# EasyEDA schematic SCH_Paul Board_2022-11-26.json

## Sheets
1 CM4 Carrier: TITLE: Winston II - CM4 Carrier; REV: 1.0; Date: 2022-11-26; Sheet: 1; Drawn By: Hotte; Company: LHD Technology
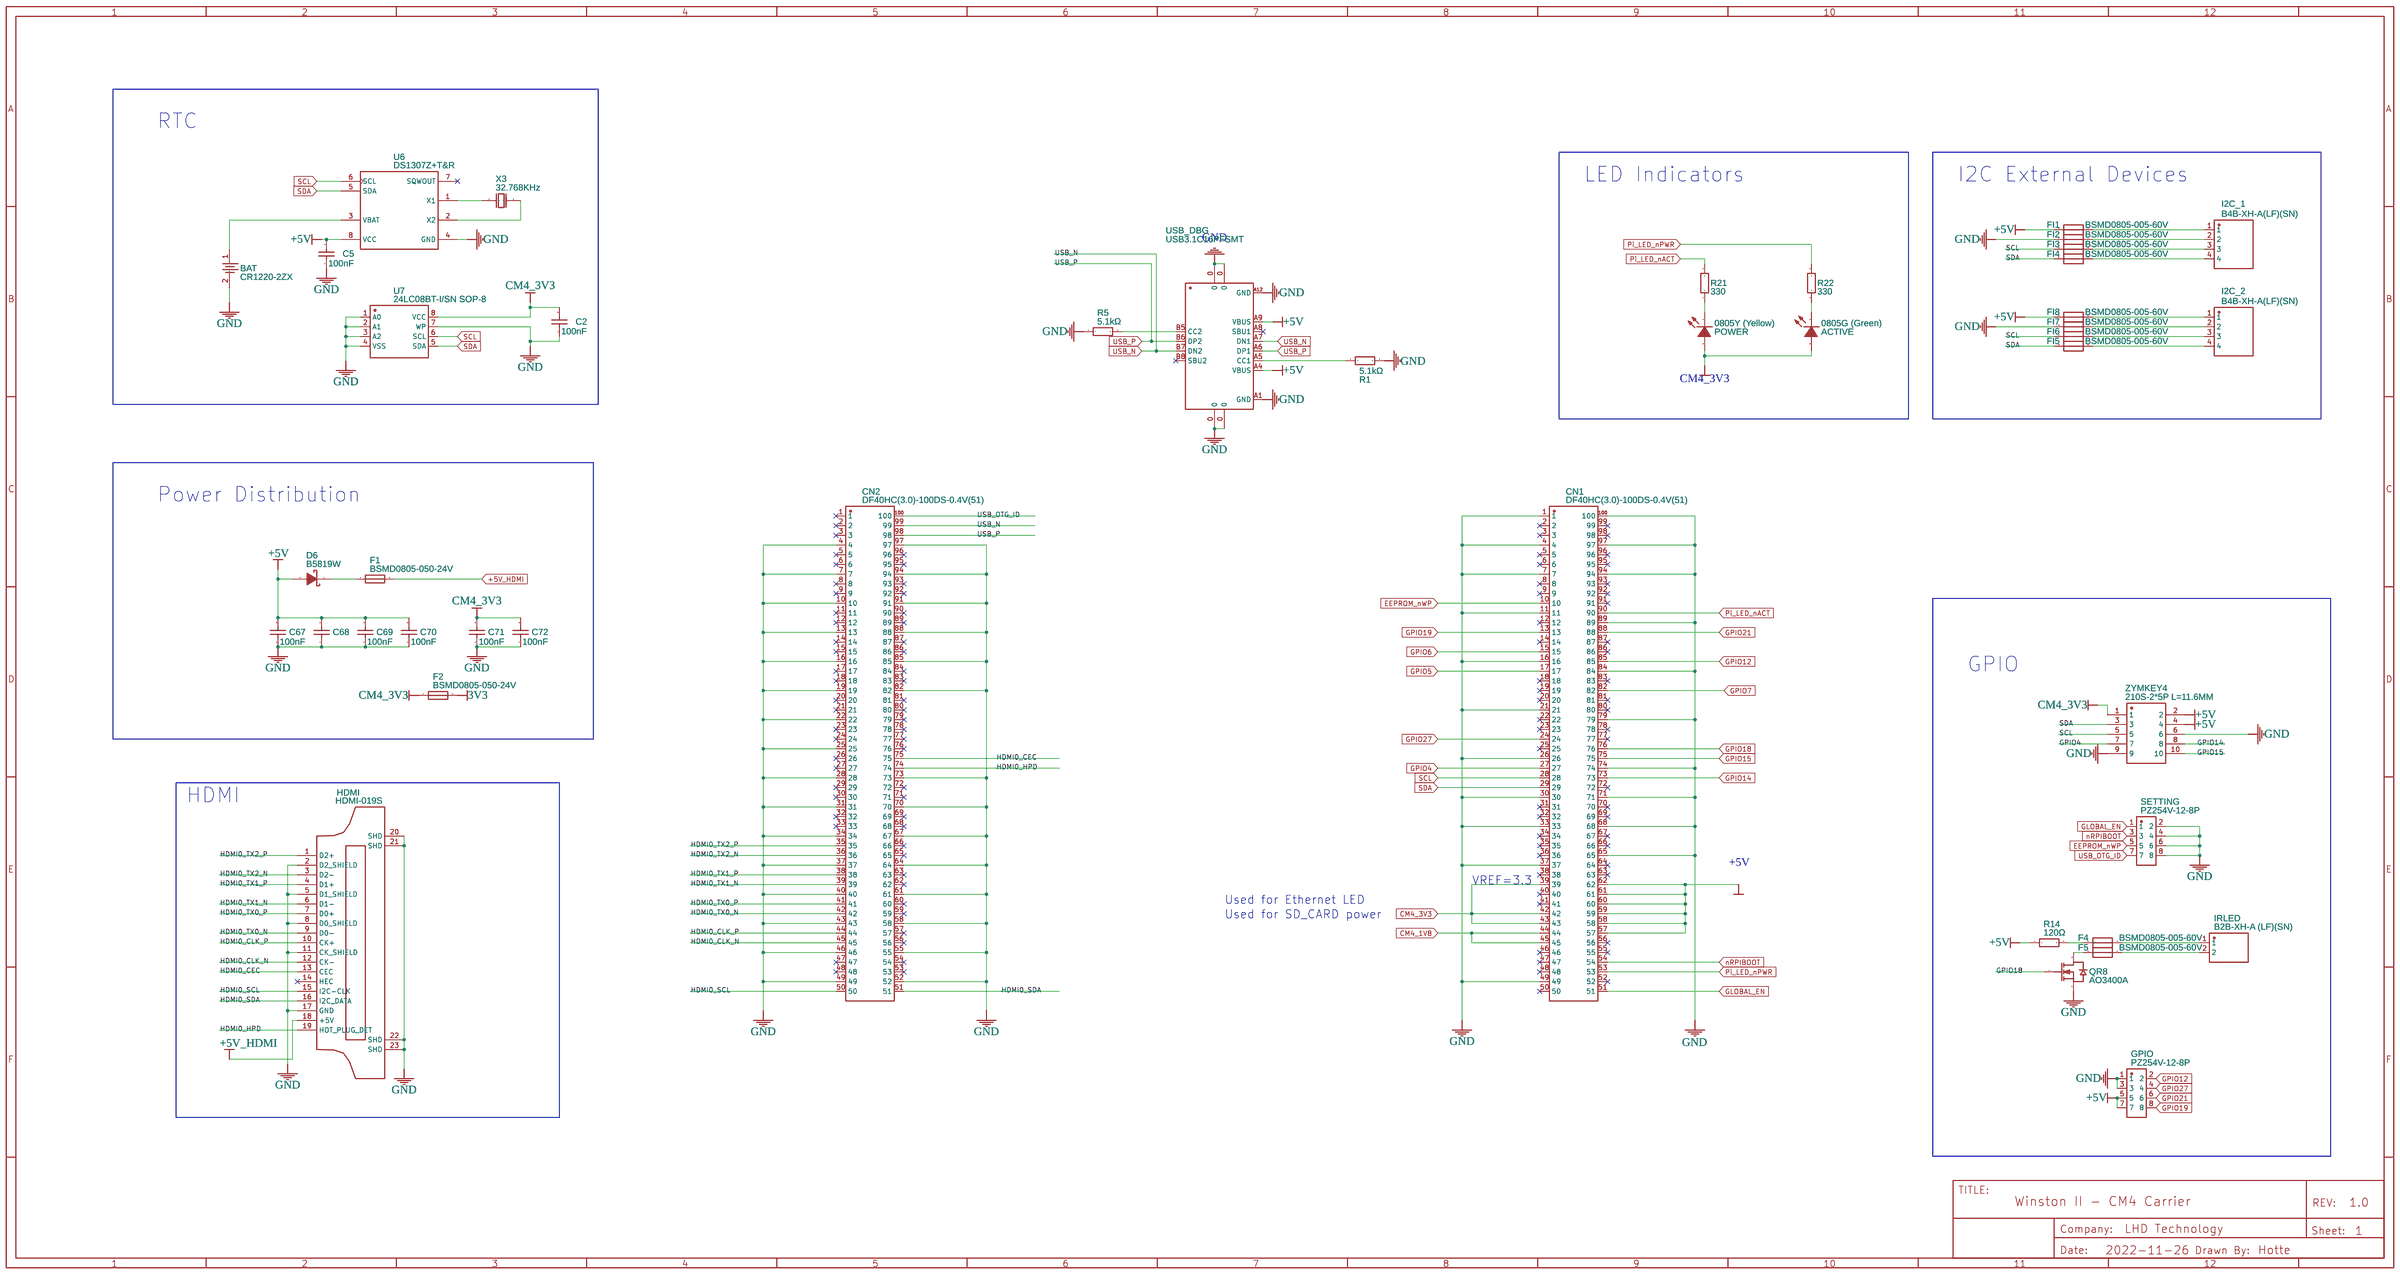
[diagram p0: CM4 Carrier]
2 Power Supply: TITLE: Power Supply; Date: 2022-11-01; Sheet: 2
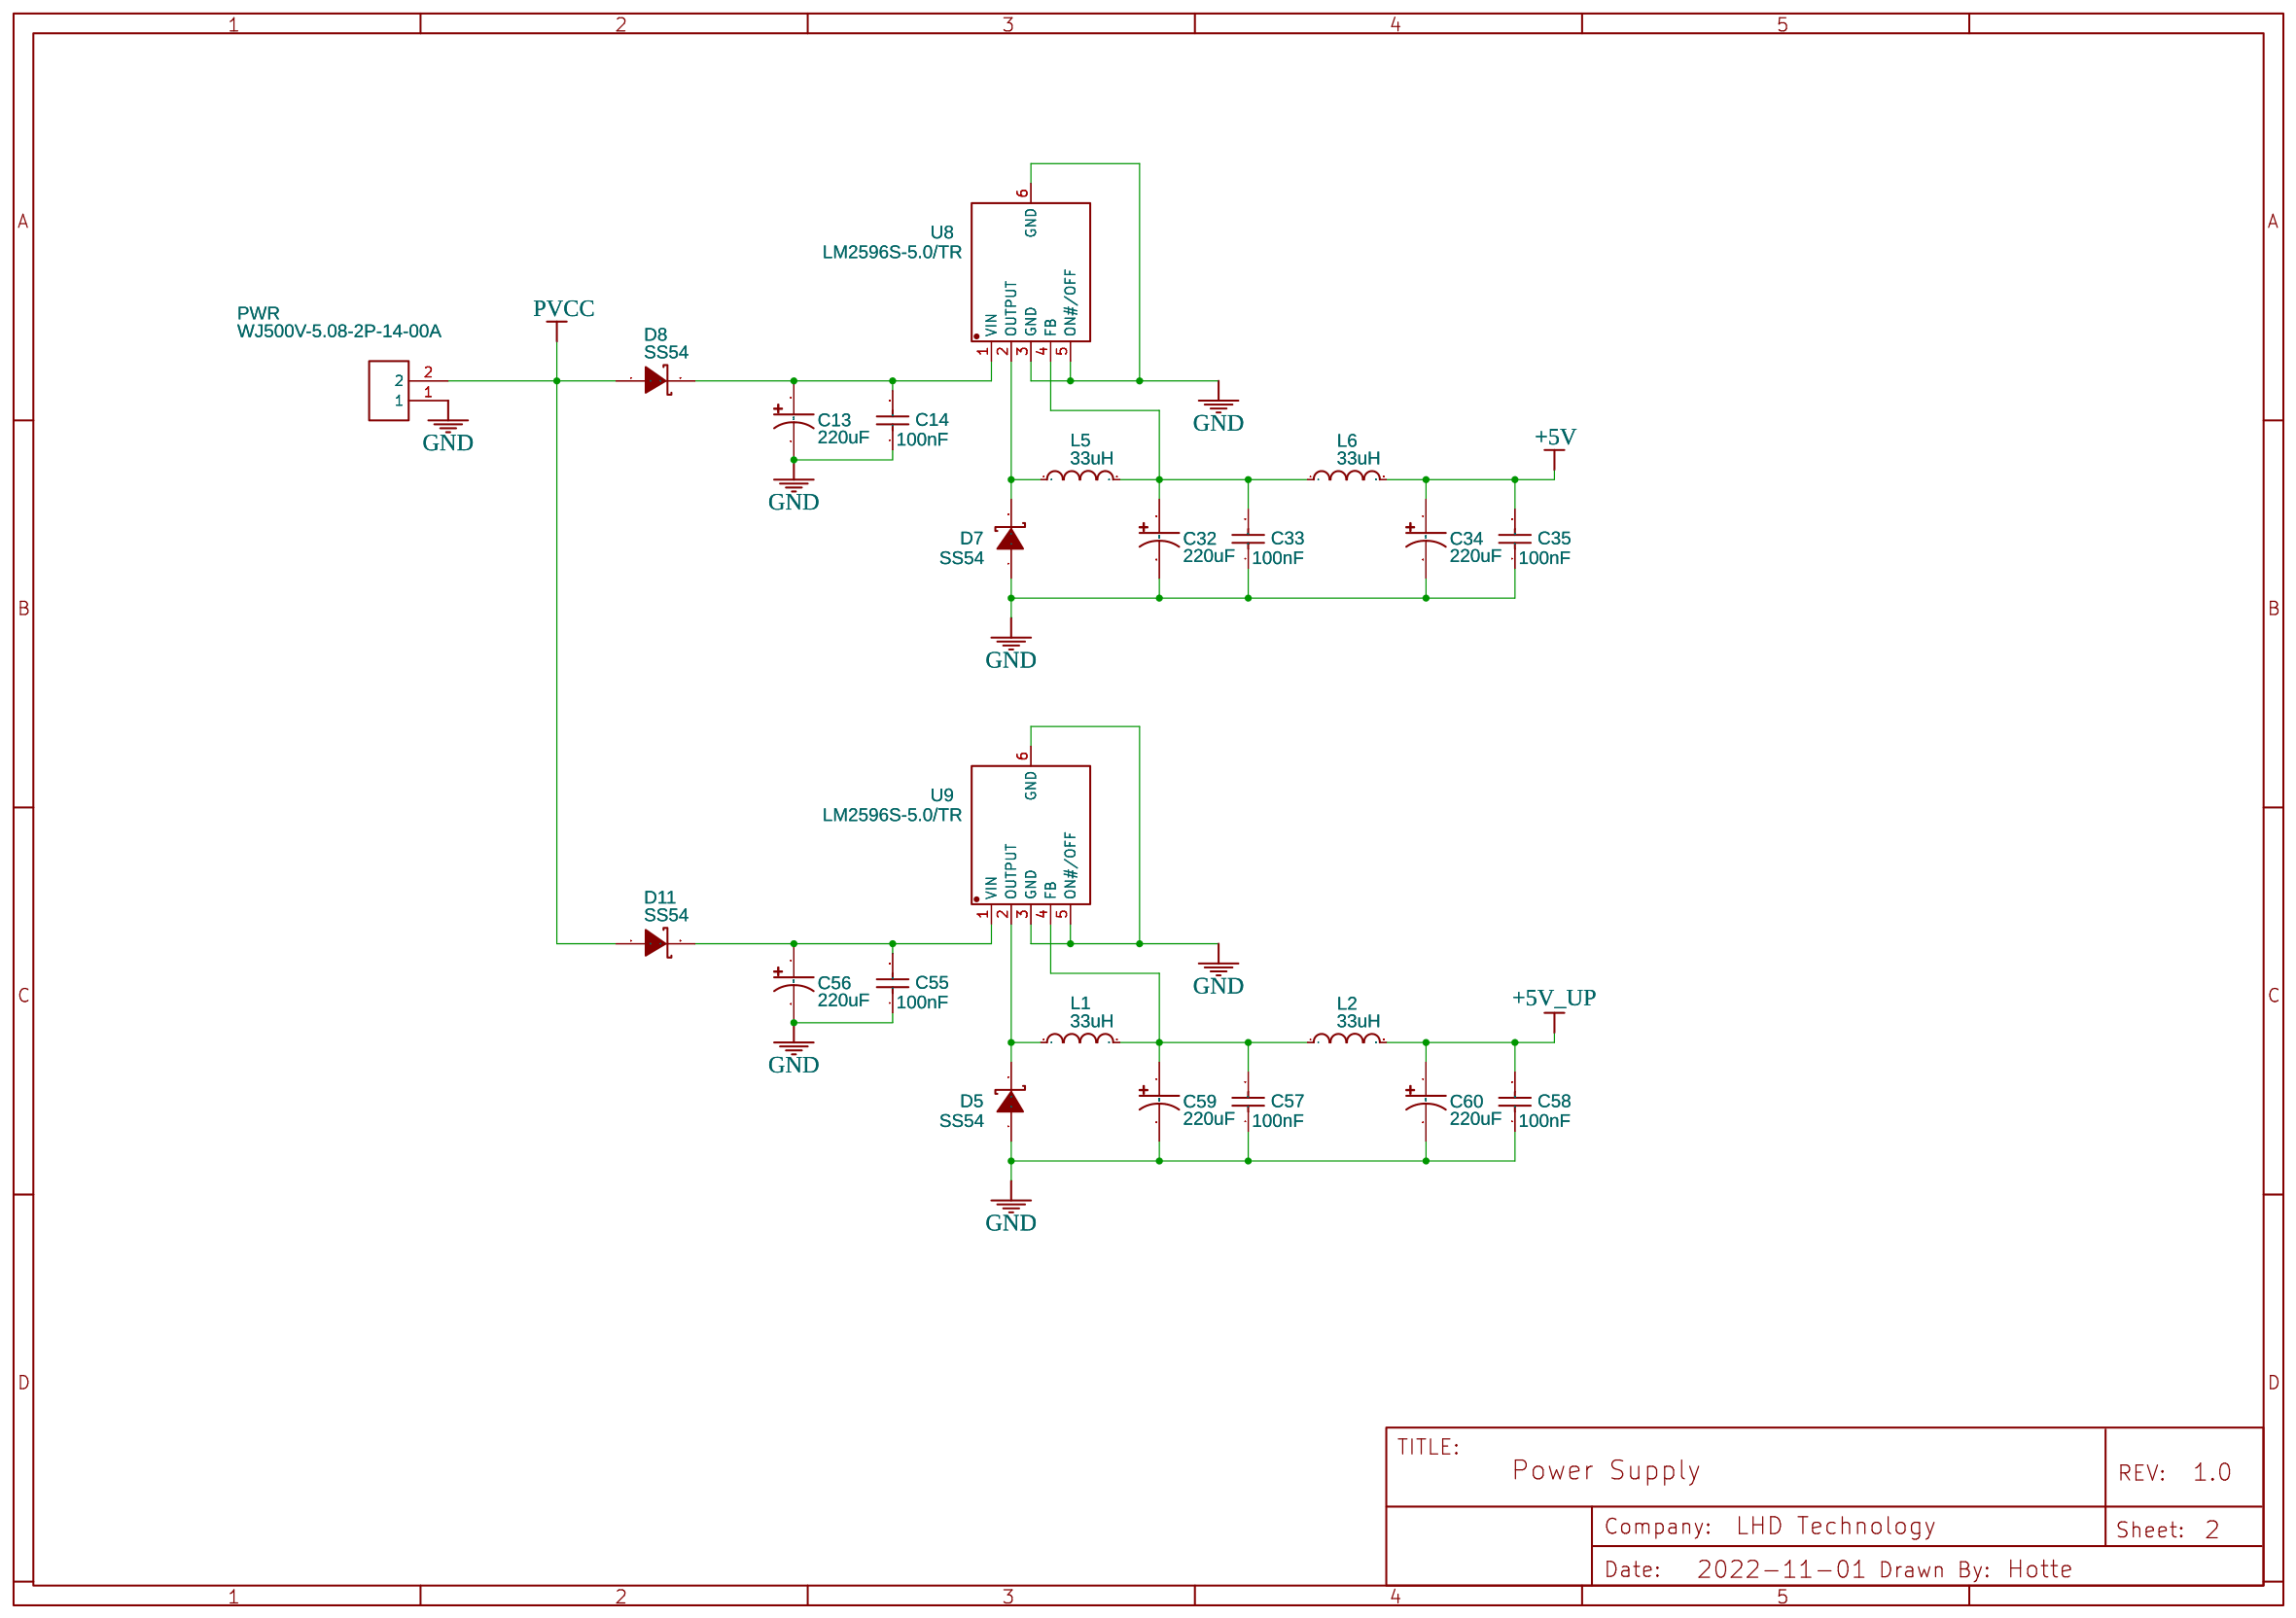
[diagram p1: Power Supply]
3 USB: TITLE: USB; Sheet: 3
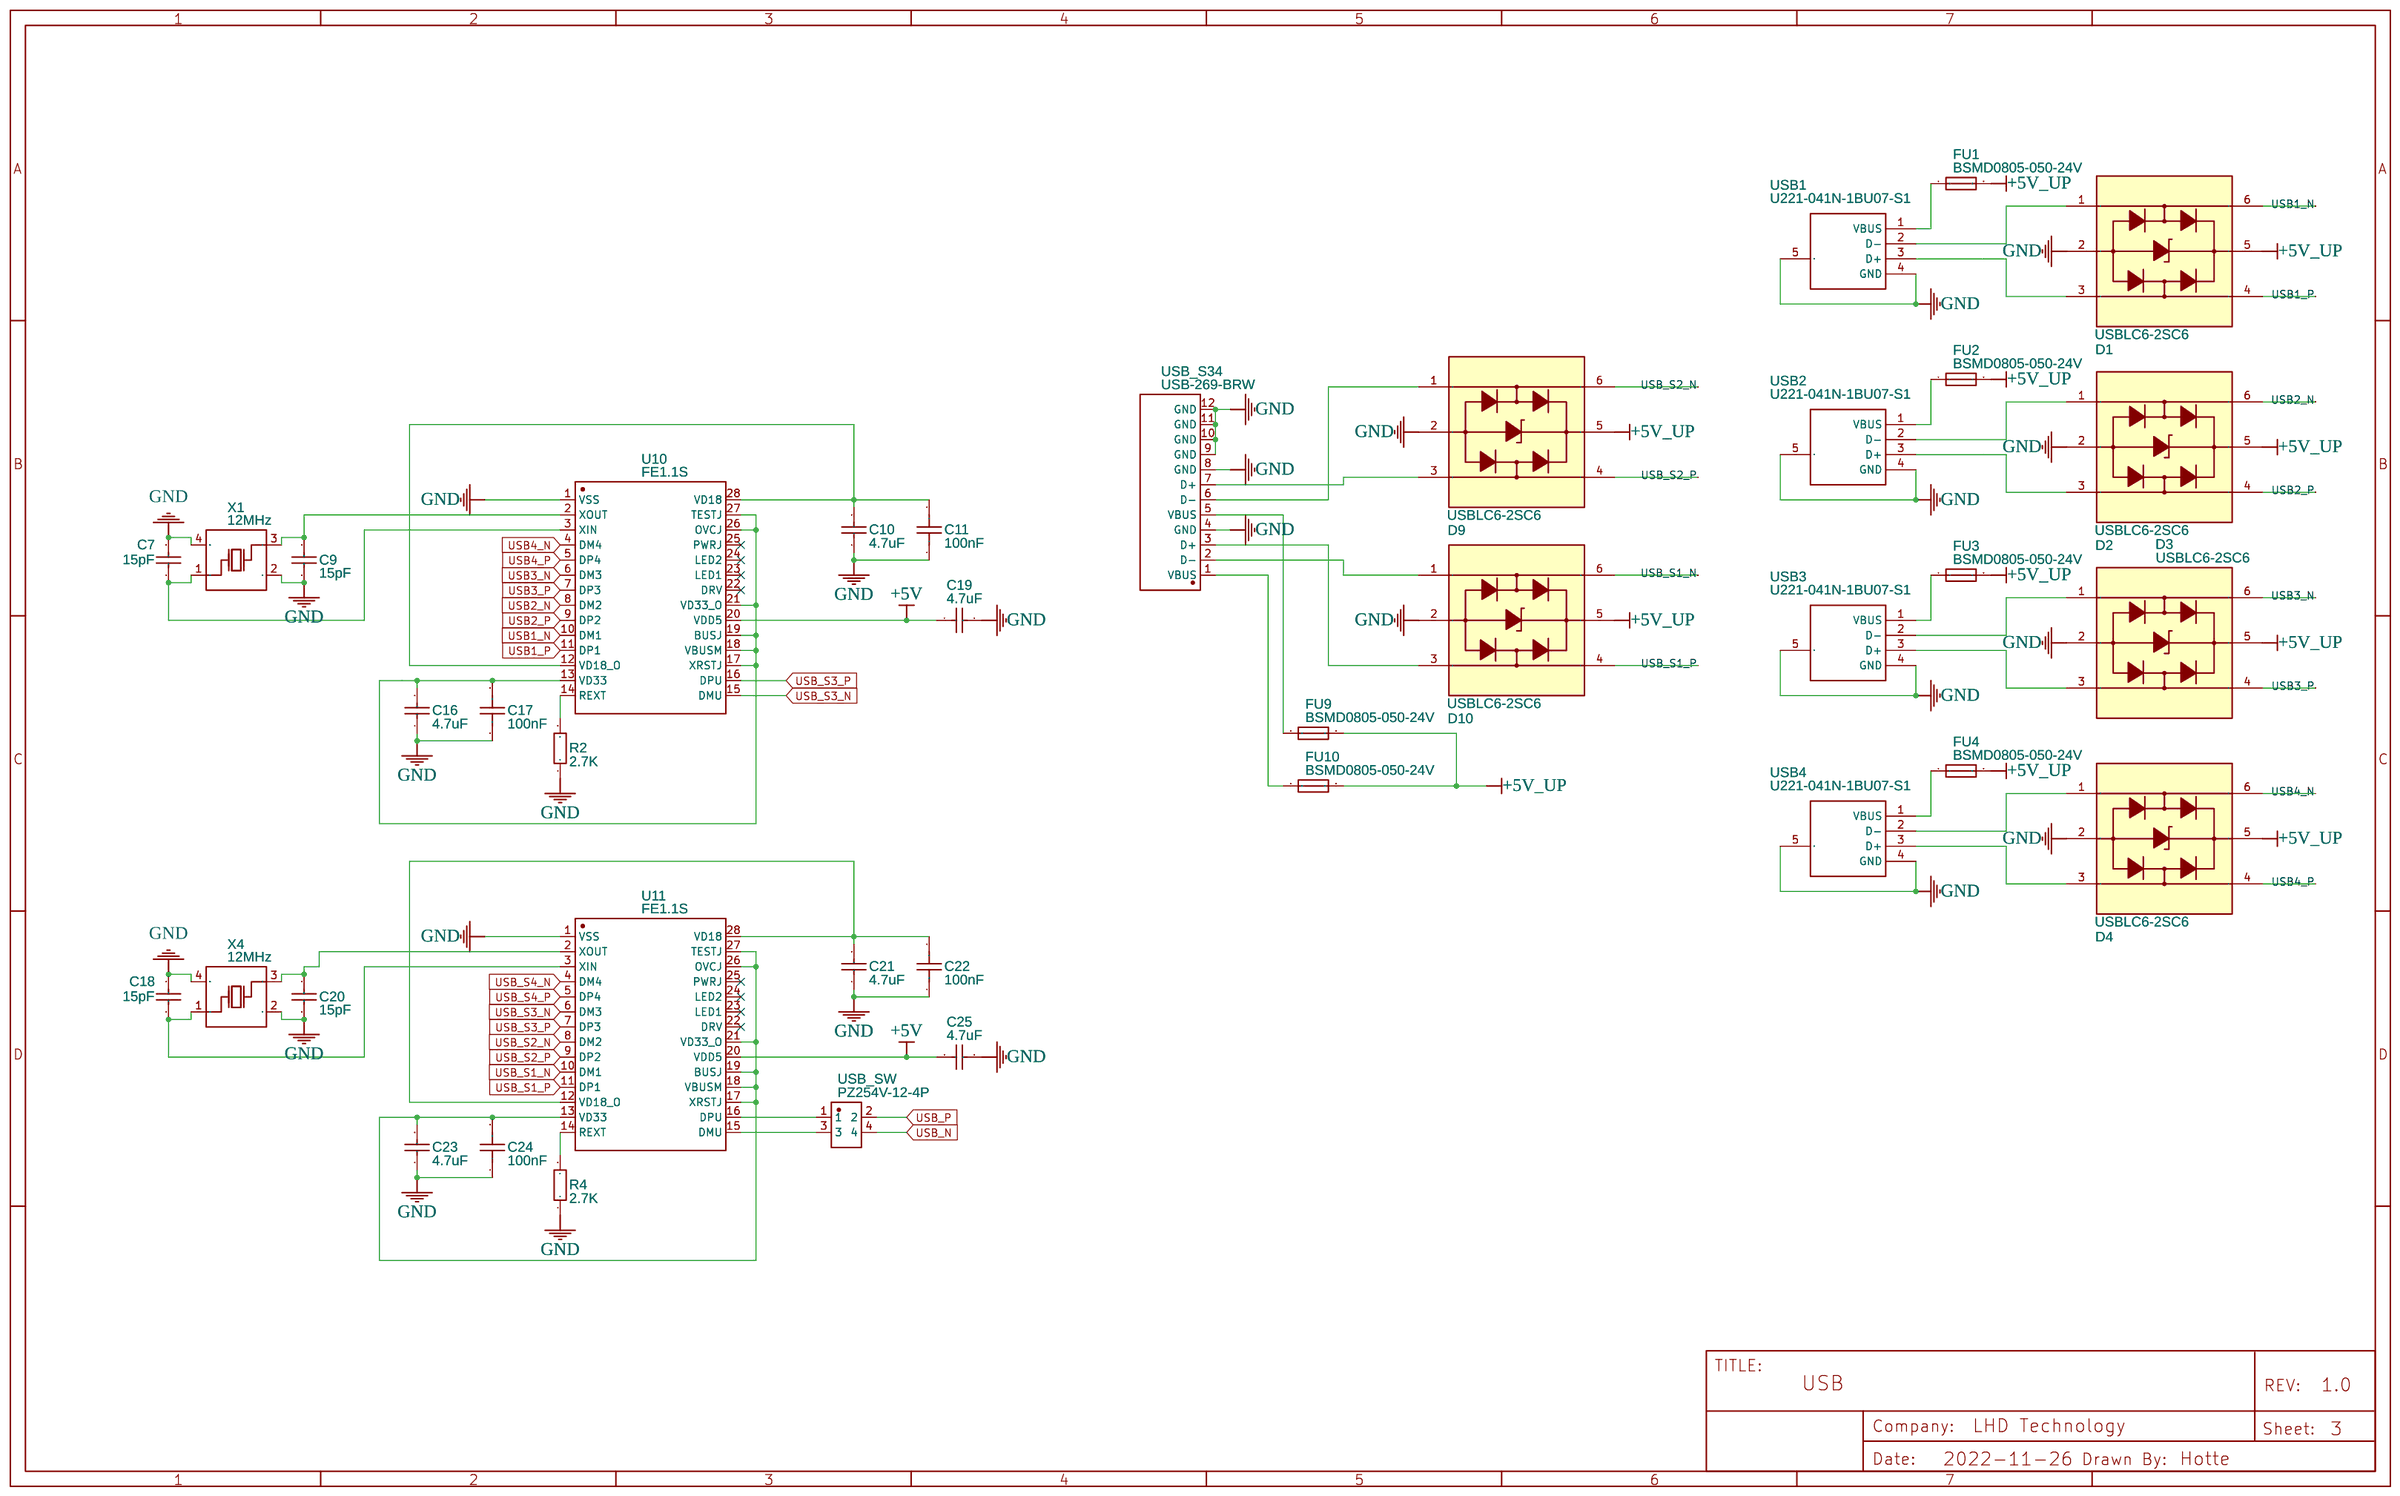
[diagram p2: USB]
4 Digital IO: TITLE: Digital IO; Date: 2022-11-02; Sheet: 4
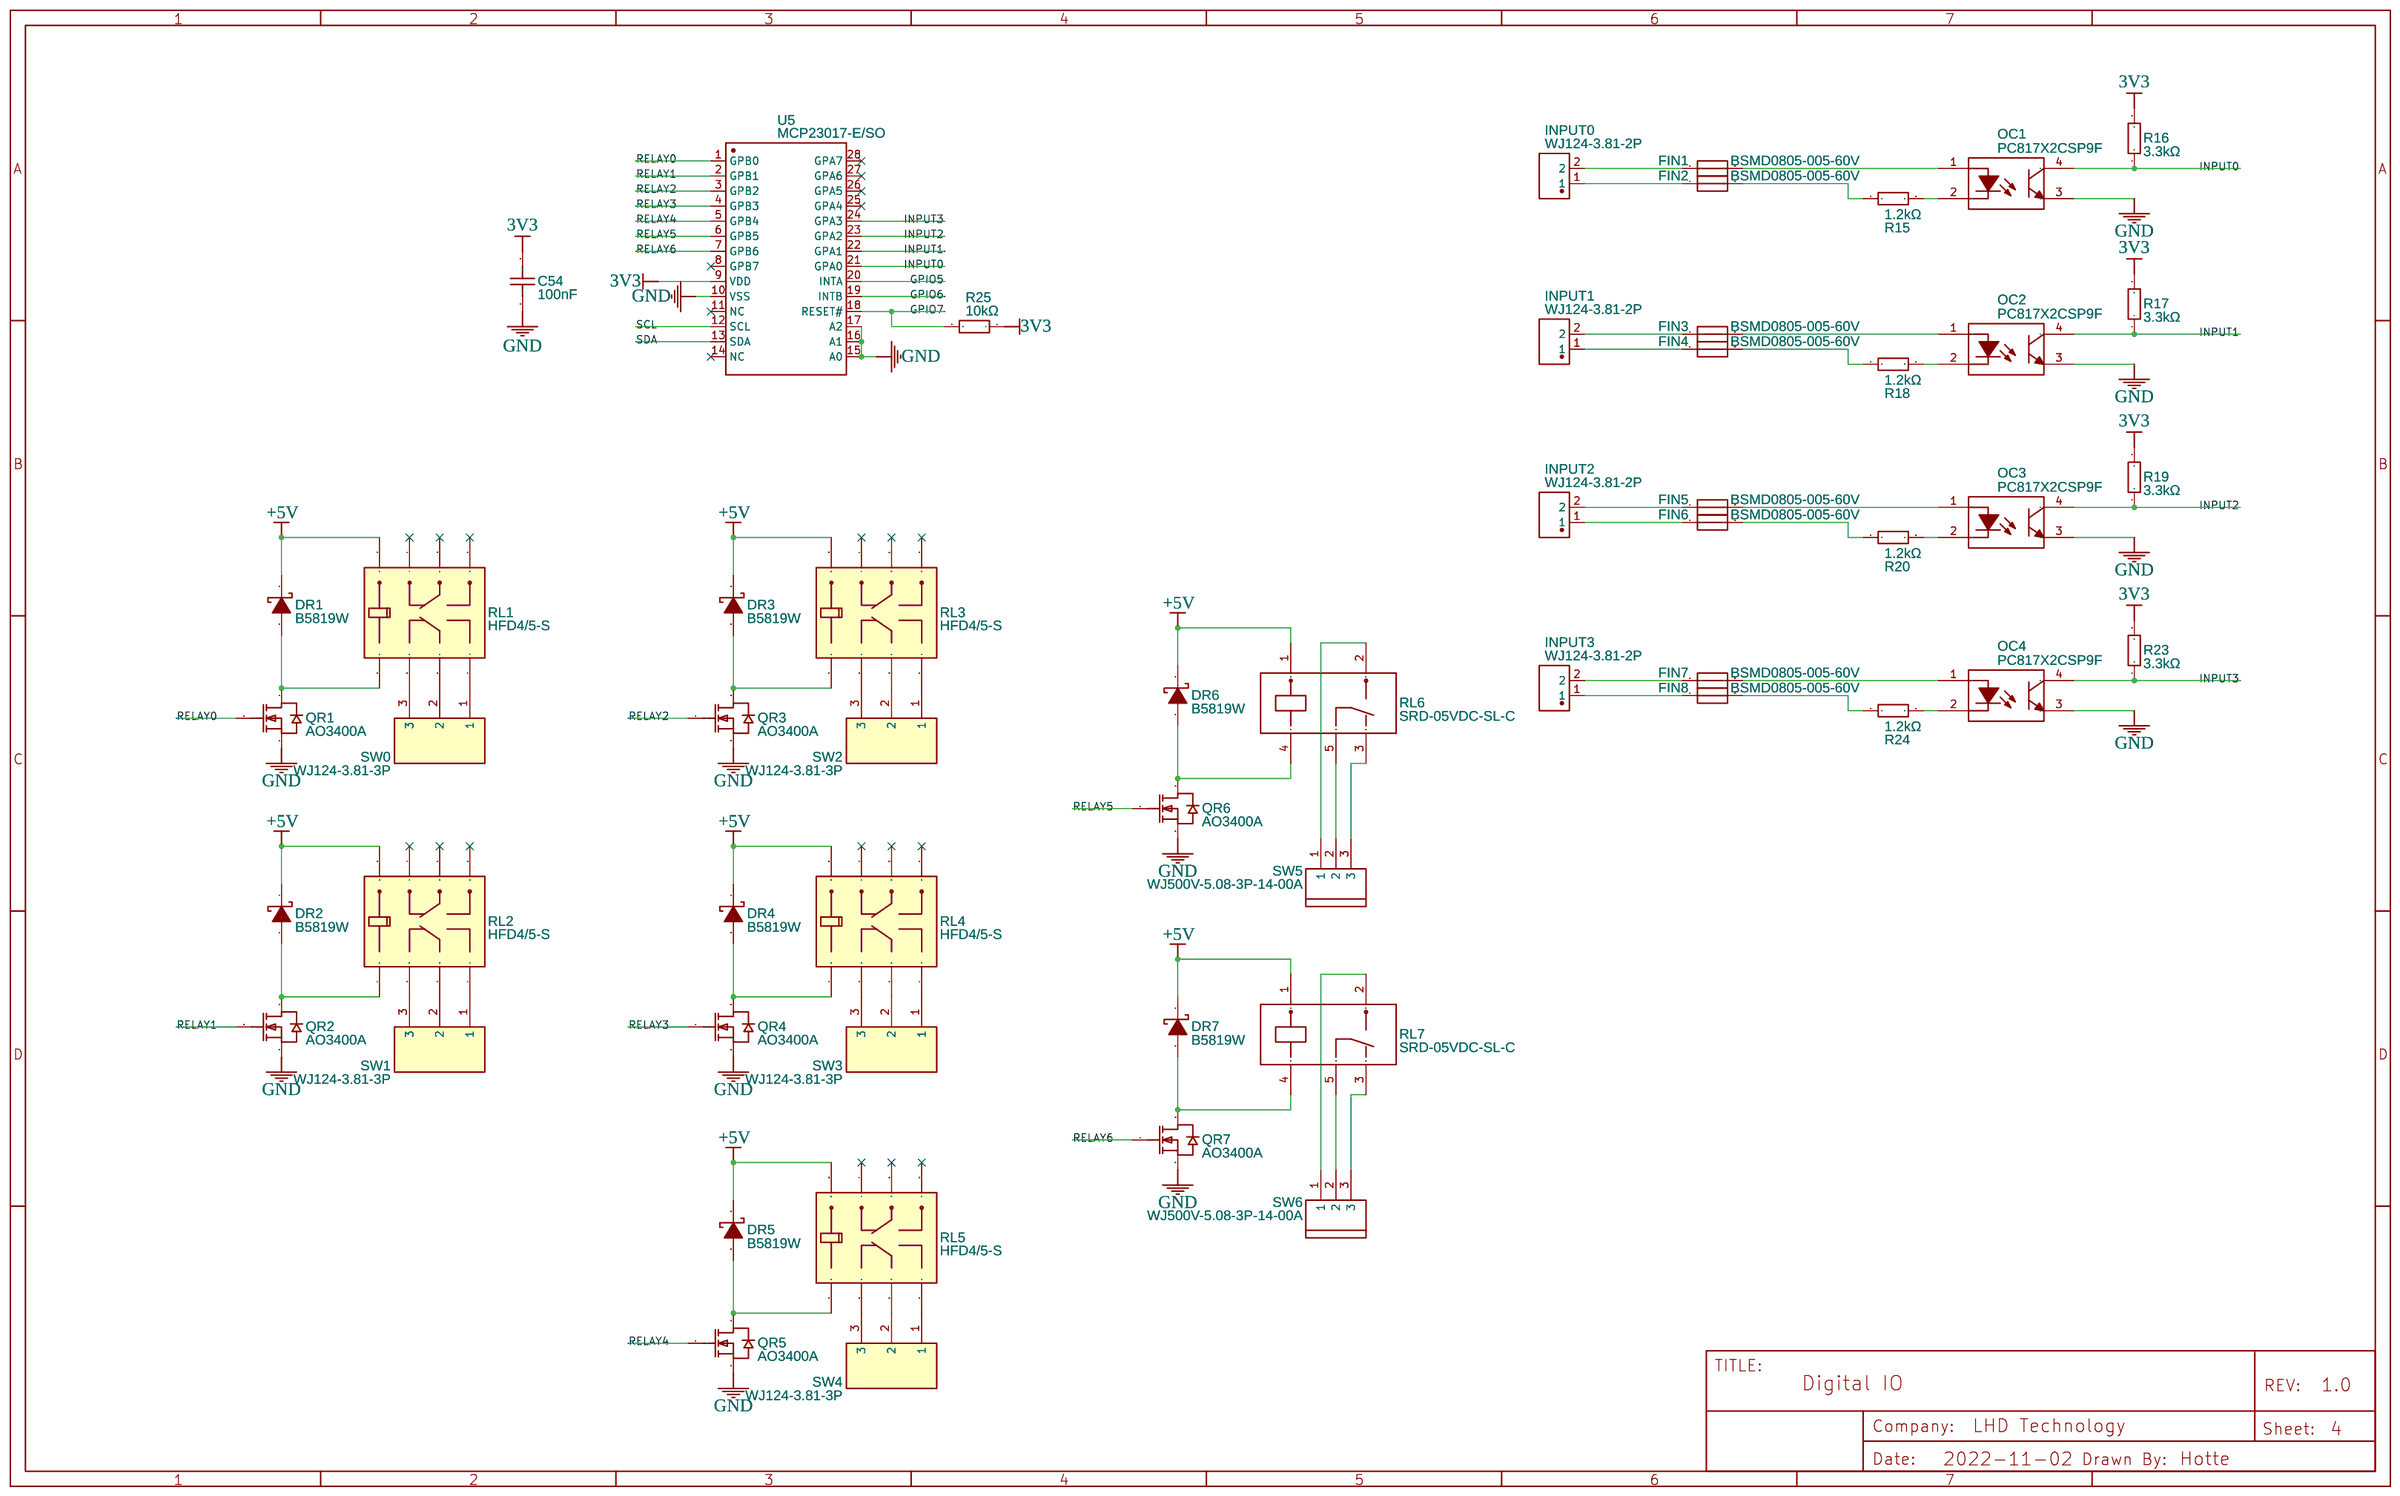
[diagram p3: Digital IO]
5 UART: TITLE: UART; Date: 2022-11-02; Sheet: 5; Drawn By: Hotte Shen
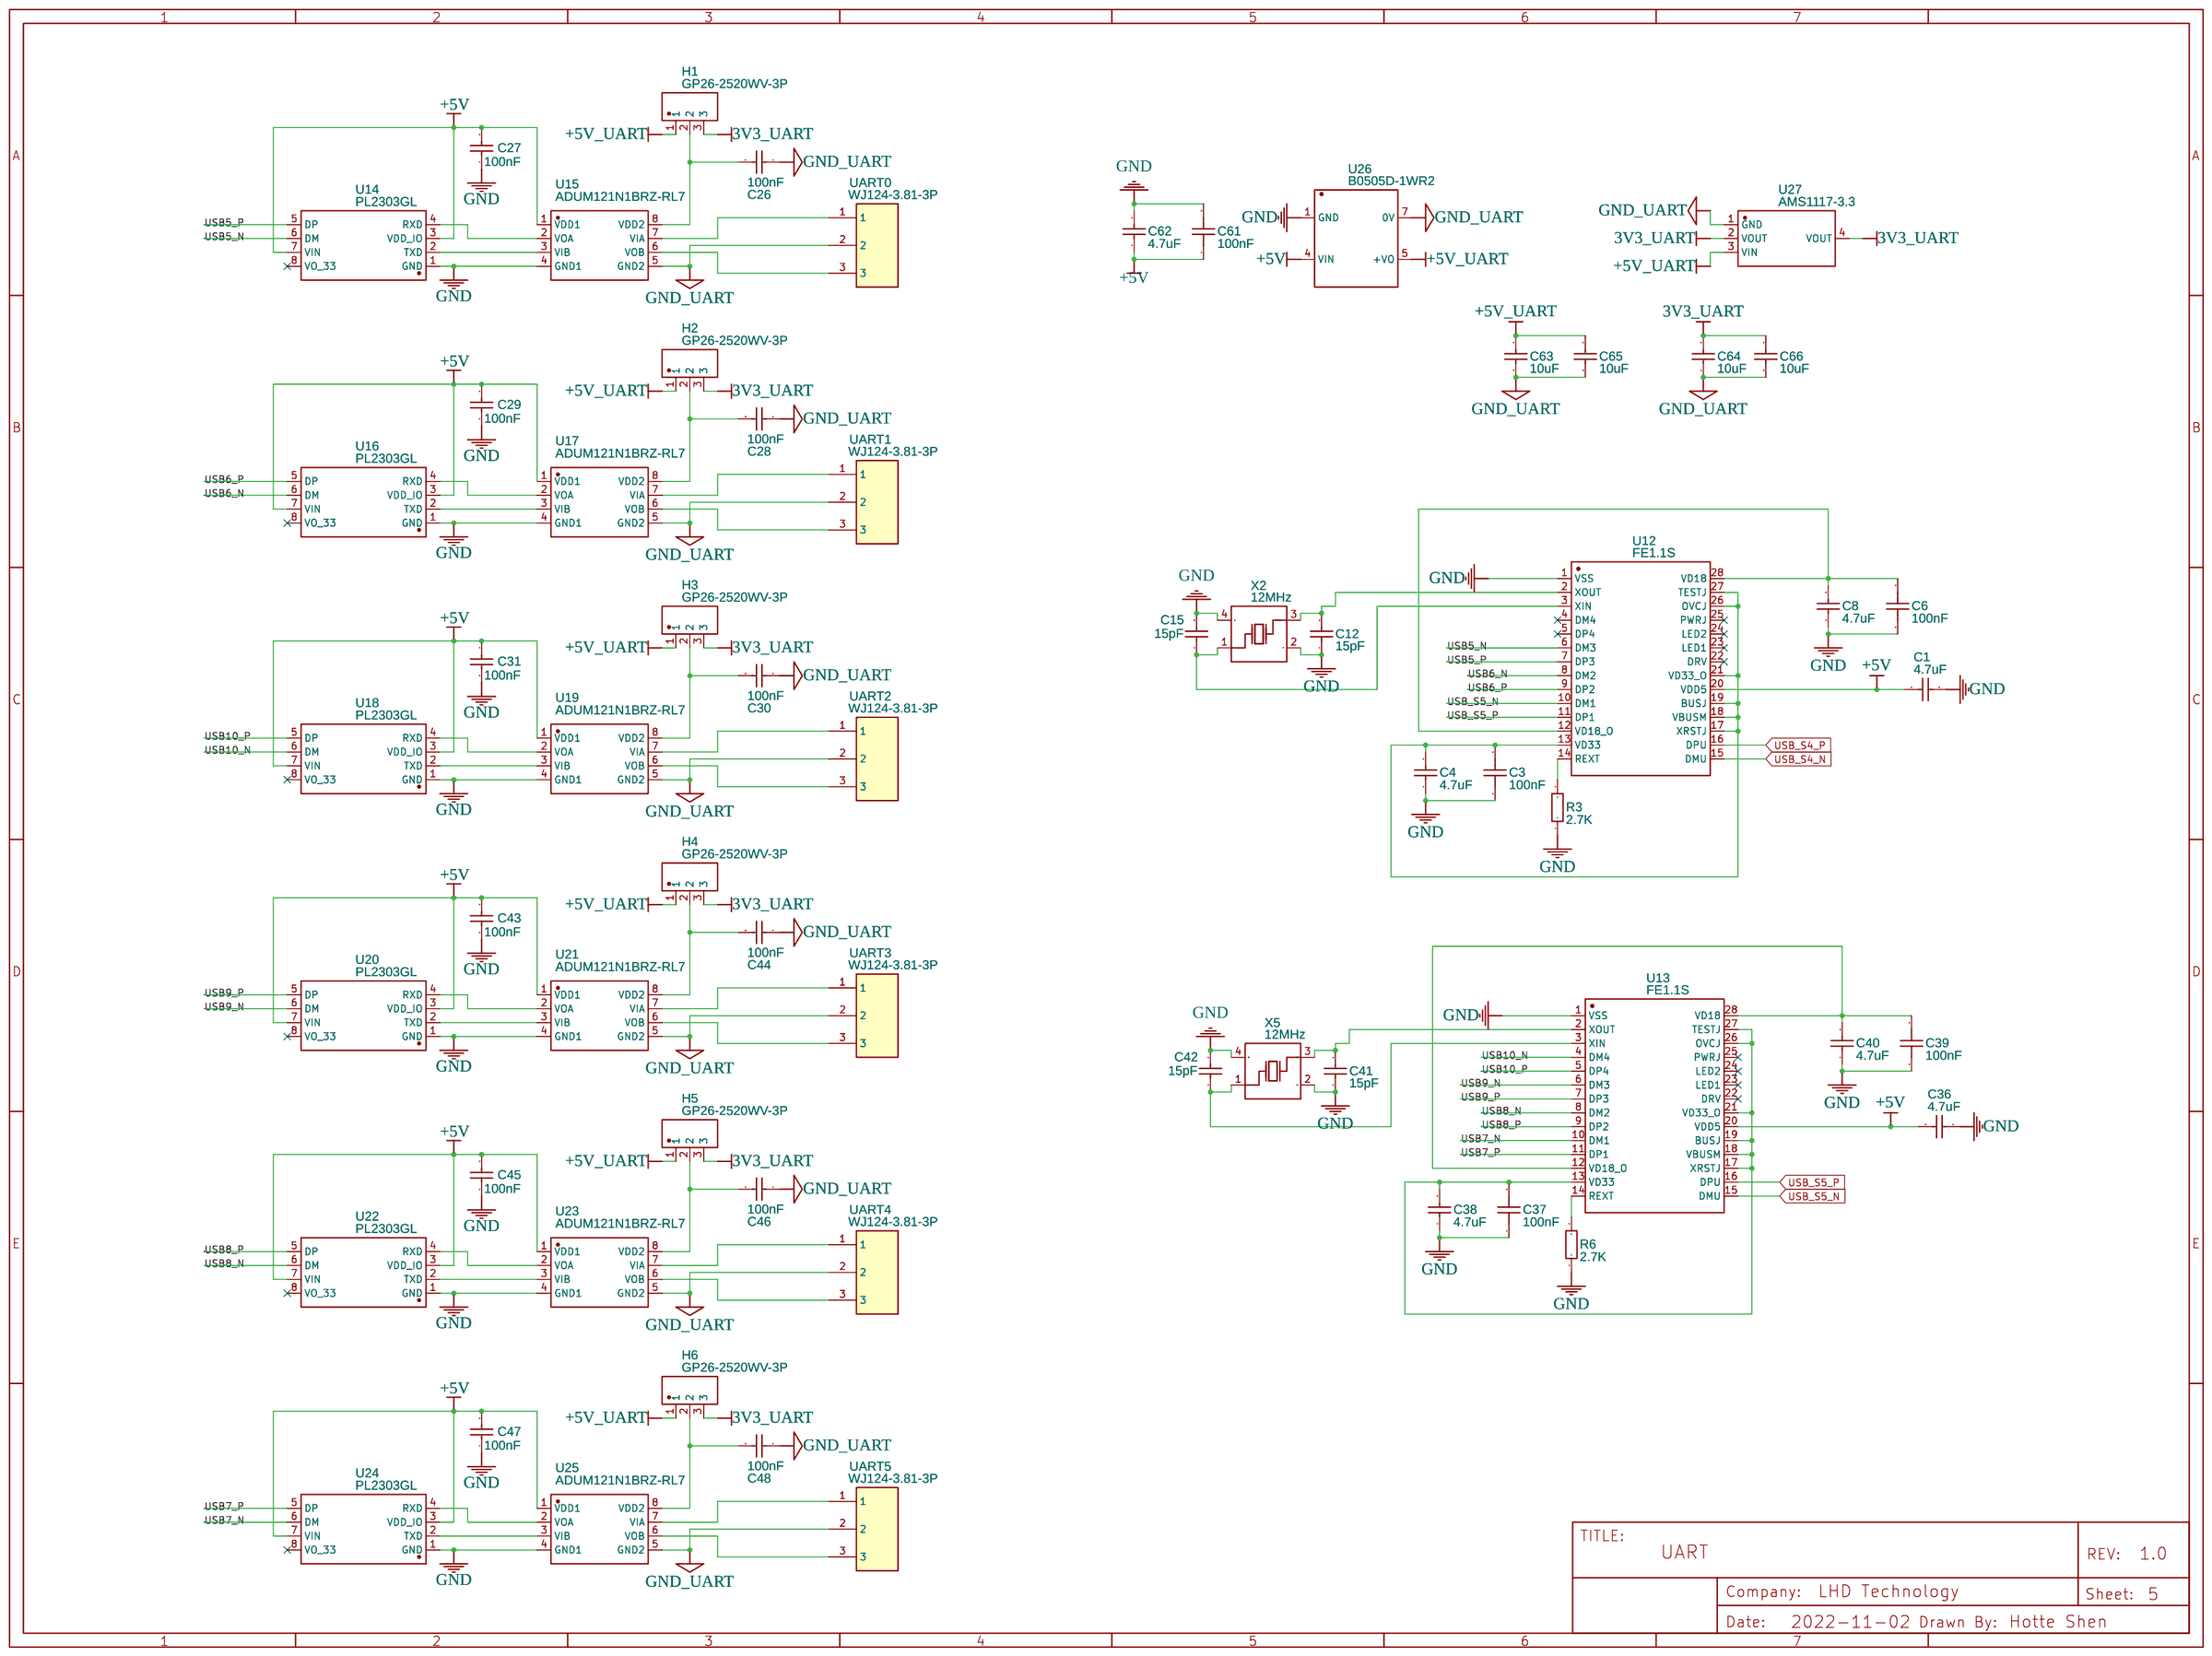
[diagram p4: UART]
6 PWM: TITLE: PWM; Date: 2022-11-02; Sheet: 6
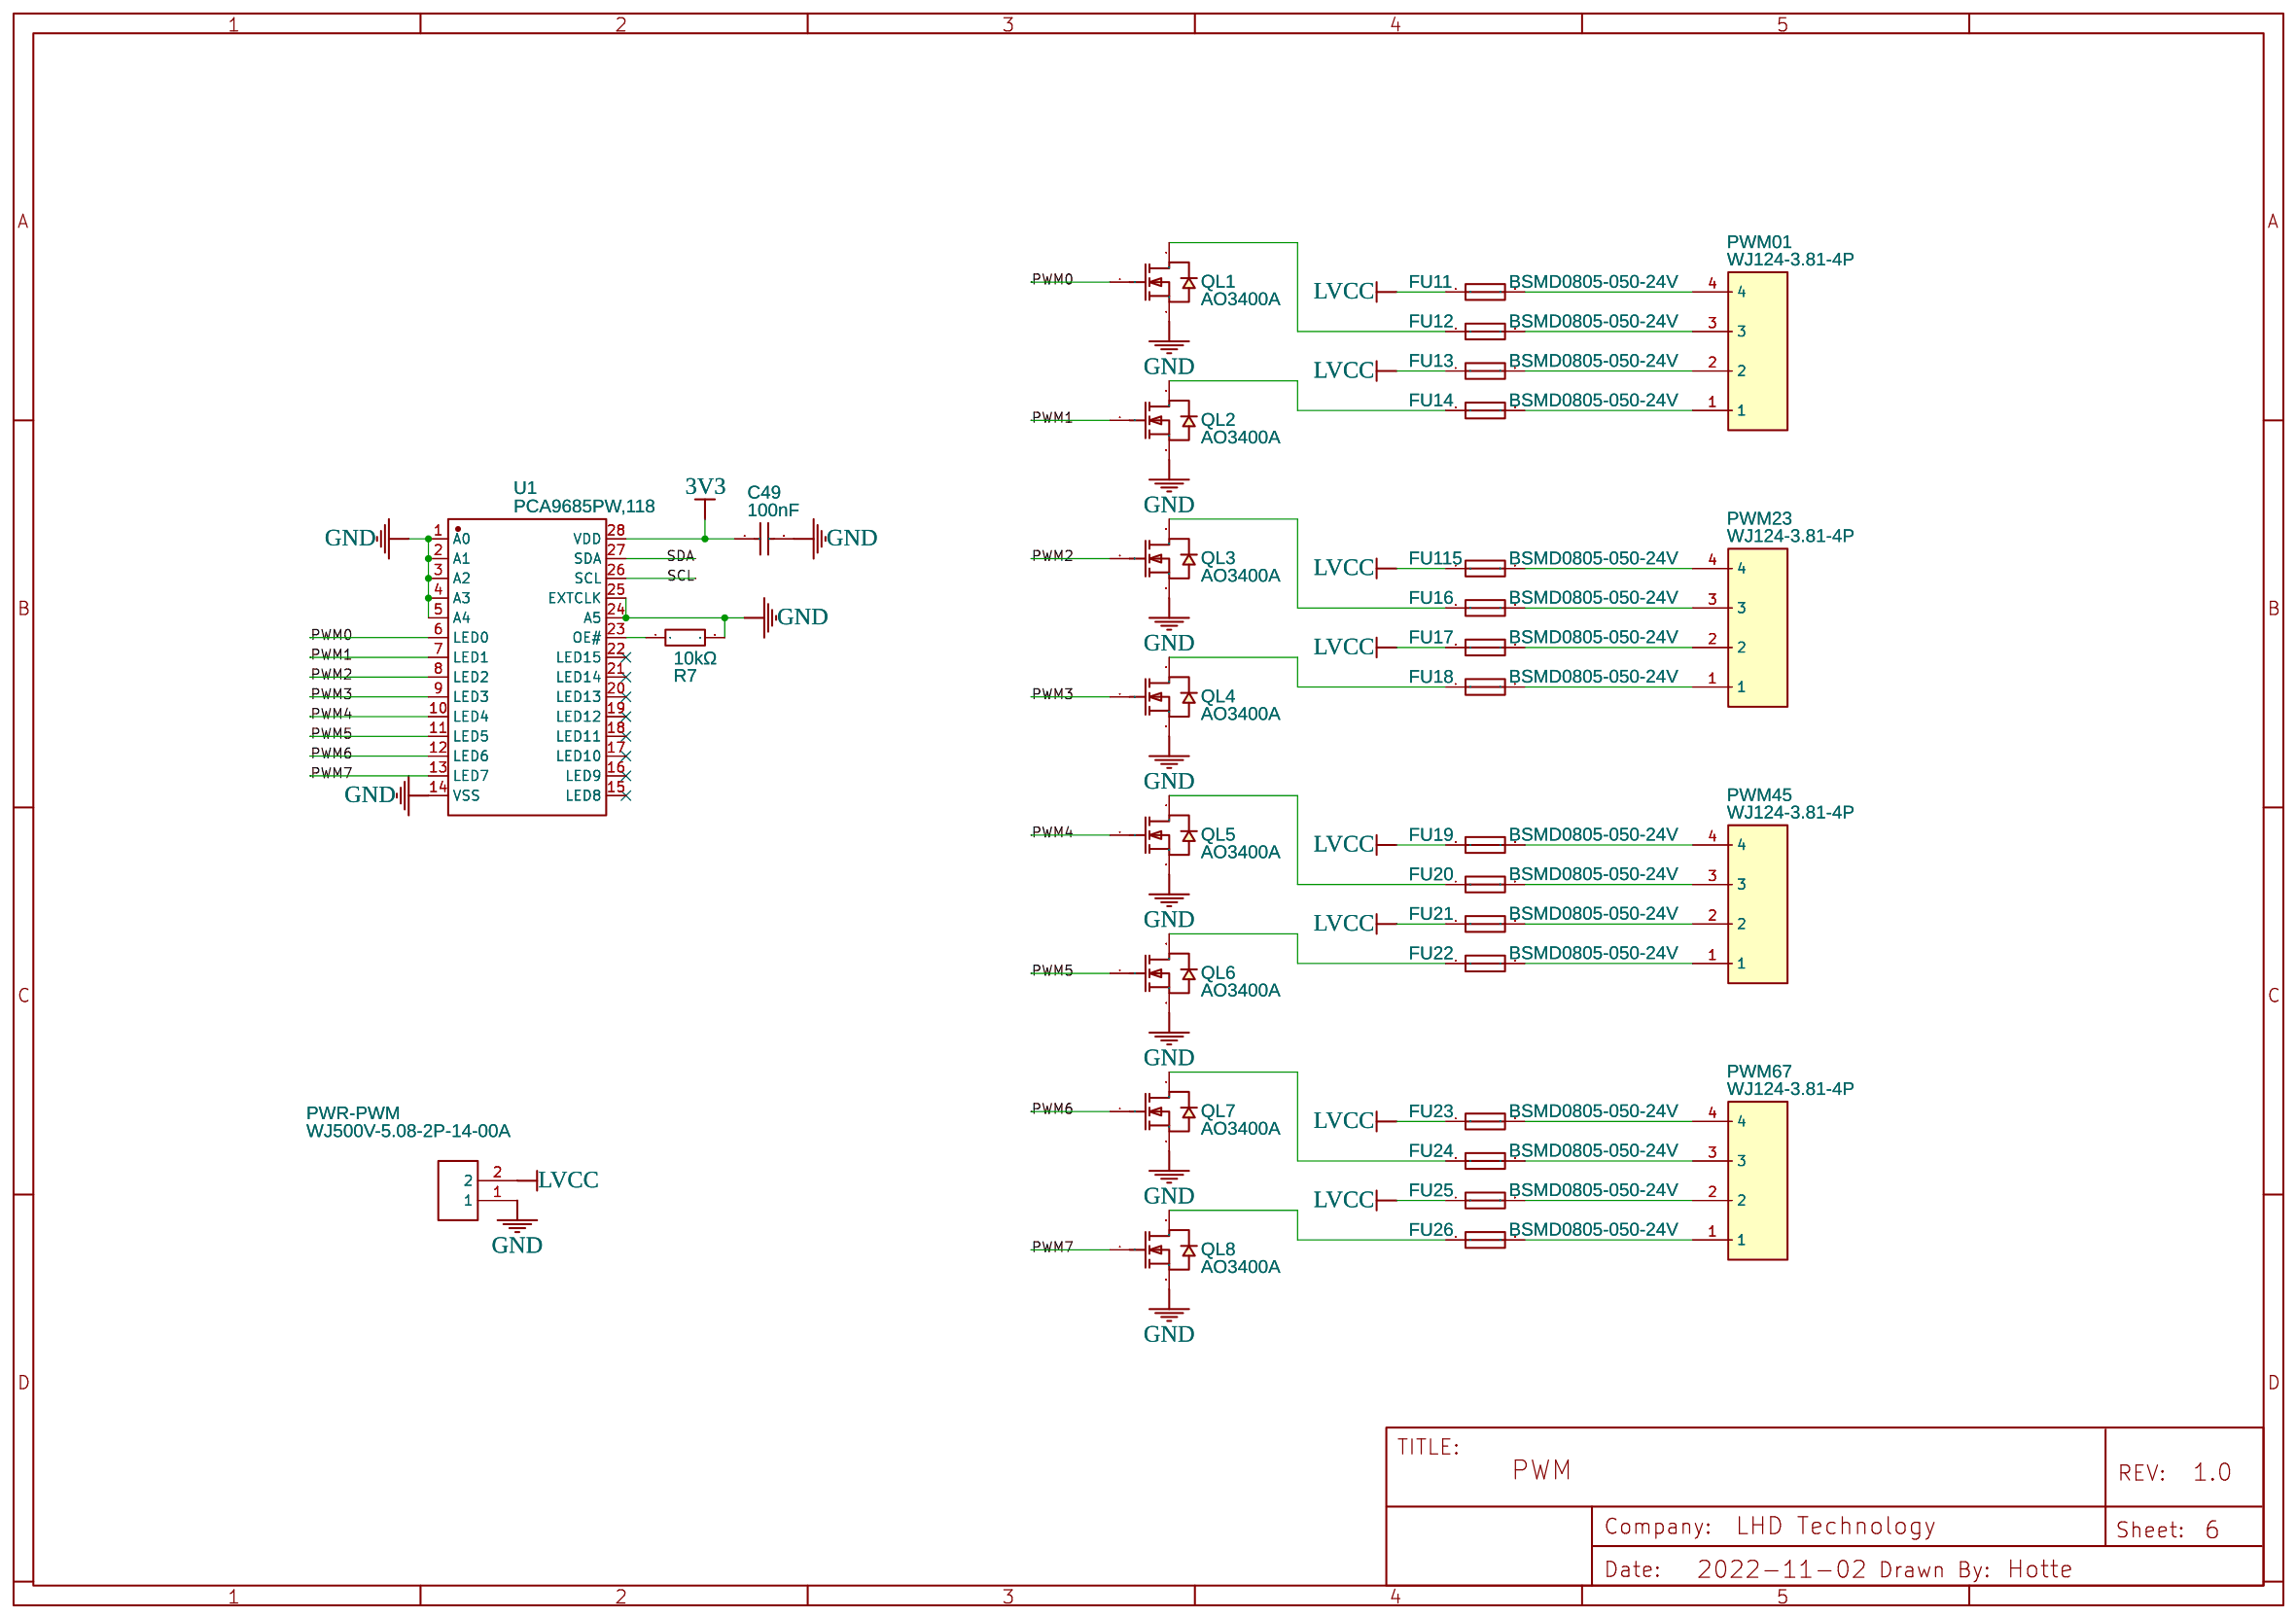
[diagram p5: PWM]
7 Sensor: TITLE: Sensor; Sheet: 7
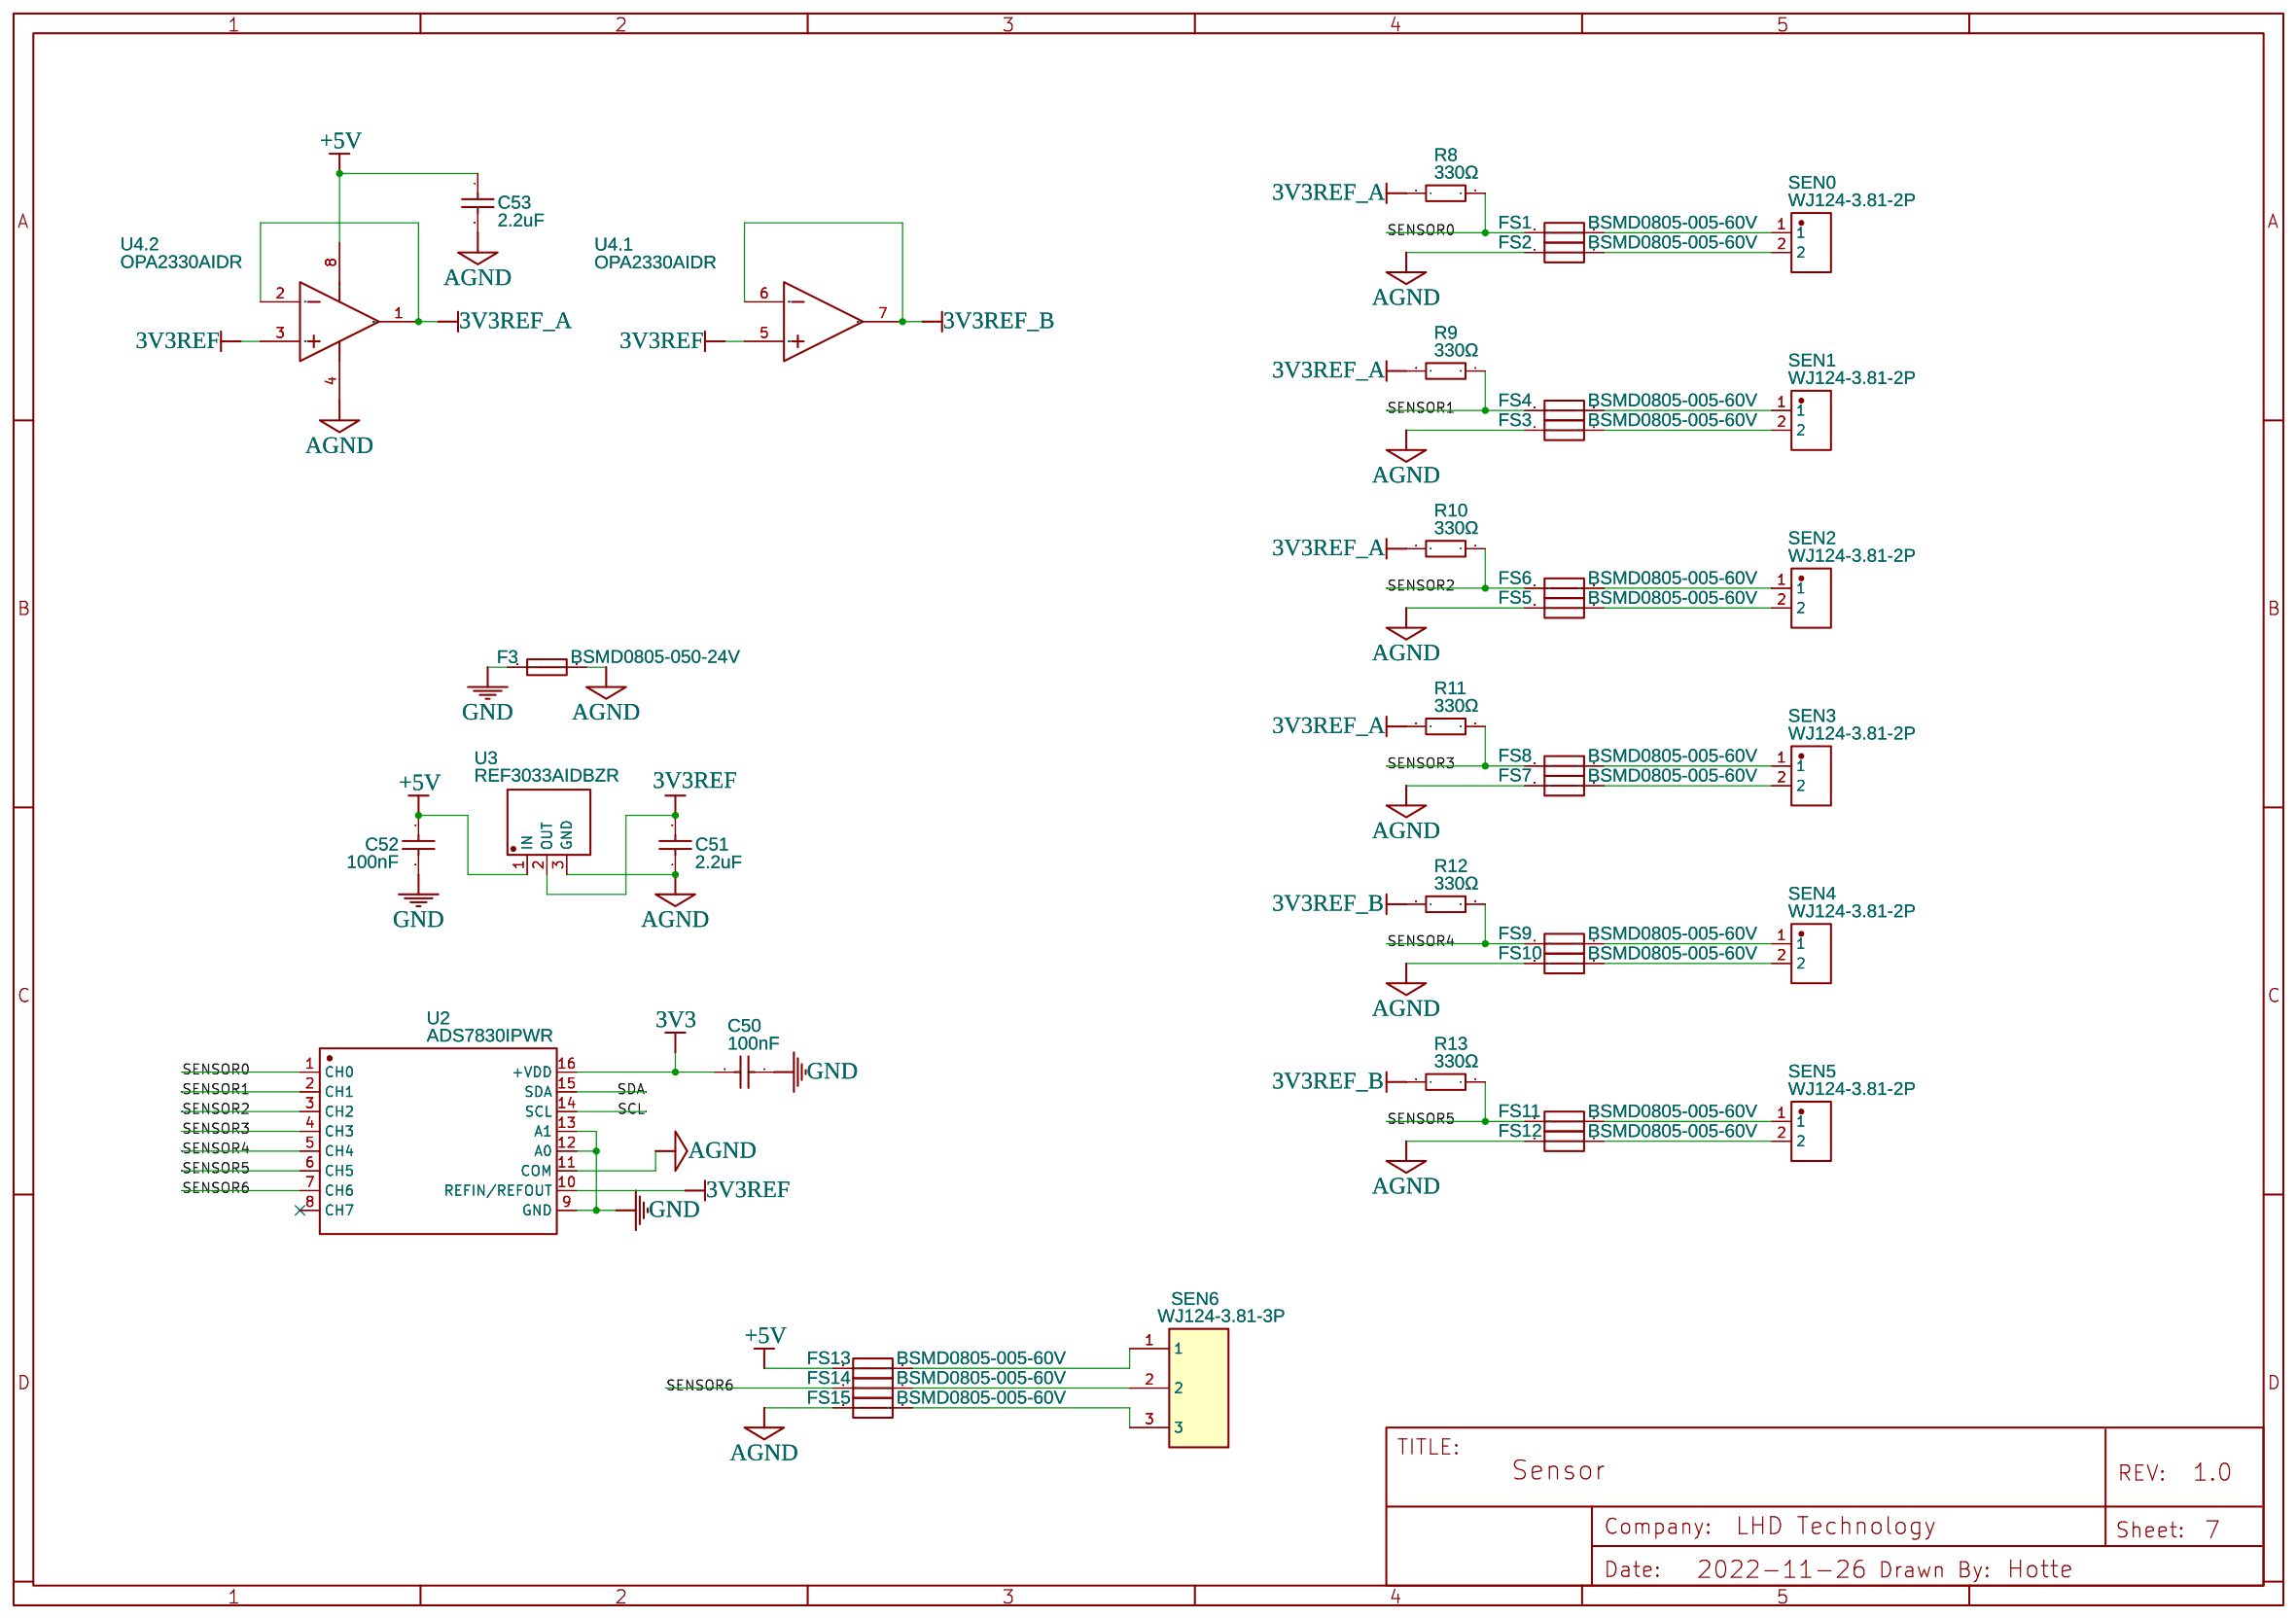
[diagram p6: Sensor]

## Parts
sheet CM4 Carrier
ACTIVE  0805G (Green)  [LED0805-RD]
BAT  CR1220-2ZX  [BAT-SMD_CR1220-2ZX]
C2  100nF  [C0805]
C5  100nF  [C0805]
C67  100nF  [C0805]
C68  100nF  [C0805]
C69  100nF  [C0805]
C70  100nF  [C0805]
C71  100nF  [C0805]
C72  100nF  [C0805]
CN1  DF40HC(3.0)-100DS-0.4V(51)  [CONN-SMD_DF40HC-3.0-100DS-0.4V-51]
CN2  DF40HC(3.0)-100DS-0.4V(51)  [CONN-SMD_DF40HC-3.0-100DS-0.4V-51]
D6  B5819W  [SOD-123_L2.7-W1.6-LS3.7-RD-1]
F1  BSMD0805-050-24V  [F0805]
F2  BSMD0805-050-24V  [F0805]
F4  BSMD0805-005-60V  [R0805]
F5  BSMD0805-005-60V  [R0805]
FI1  BSMD0805-005-60V  [R0805]
FI2  BSMD0805-005-60V  [R0805]
FI3  BSMD0805-005-60V  [R0805]
FI4  BSMD0805-005-60V  [R0805]
FI5  BSMD0805-005-60V  [R0805]
FI6  BSMD0805-005-60V  [R0805]
FI7  BSMD0805-005-60V  [R0805]
FI8  BSMD0805-005-60V  [R0805]
GPIO  PZ254V-12-8P  [HDR-TH_8P-P2.54-V-M-R2-C4-S2.54]
HDMI  HDMI-019S  [HDMI-SMD_HDMI-019S]
I2C_1  B4B-XH-A(LF)(SN)  [CONN-TH_B4B-XH-A-LF-SN]
I2C_2  B4B-XH-A(LF)(SN)  [CONN-TH_B4B-XH-A-LF-SN]
IRLED  B2B-XH-A (LF)(SN)  [CONN-TH_B2B-XH-A-LF-SN]
POWER  0805Y (Yellow)  [LED0805-RD]
QR8  AO3400A  [SOT-23-3_L2.9-W1.6-P1.90-LS2.8-BR]
R1  5.1kΩ  [R0603]
R5  5.1kΩ  [R0603]
R14  120Ω  [R0805]
R21  330  [R0805]
R22  330  [R0805]
SETTING  PZ254V-12-8P  [HDR-TH_8P-P2.54-V-M-R2-C4-S2.54]
U6  DS1307Z+T&R  [SOIC-8_L5.0-W4.0-P1.27-LS6.0-BL]
U7  24LC08BT-I/SN SOP-8  [SOIC-8_L4.9-W3.9-P1.27-LS6.0-BL]
USB_DBG  USB3.1C16PFSMT  [USB-C-SMD_TYPE-C-USB-17]
X3  32.768KHz  [OSC-SMD_2P-L3.2-W1.5]
ZYMKEY4  210S-2*5P L=11.6MM  [HDR-TH_10P-P2.54-V-M-R2-C5-S2.54]
sheet Digital IO
C54  100nF  [C0603]
DR1  B5819W  [SOD-123_L2.7-W1.6-LS3.7-RD-1]
DR2  B5819W  [SOD-123_L2.7-W1.6-LS3.7-RD-1]
DR3  B5819W  [SOD-123_L2.7-W1.6-LS3.7-RD-1]
DR4  B5819W  [SOD-123_L2.7-W1.6-LS3.7-RD-1]
DR5  B5819W  [SOD-123_L2.7-W1.6-LS3.7-RD-1]
DR6  B5819W  [SOD-123_L2.7-W1.6-LS3.7-RD-1]
DR7  B5819W  [SOD-123_L2.7-W1.6-LS3.7-RD-1]
FIN1  BSMD0805-005-60V  [R0805]
FIN2  BSMD0805-005-60V  [R0805]
FIN3  BSMD0805-005-60V  [R0805]
FIN4  BSMD0805-005-60V  [R0805]
FIN5  BSMD0805-005-60V  [R0805]
FIN6  BSMD0805-005-60V  [R0805]
FIN7  BSMD0805-005-60V  [R0805]
FIN8  BSMD0805-005-60V  [R0805]
INPUT0  WJ124-3.81-2P  [CONN-TH_2P-P3.81_KF124-3.81-2P]
INPUT1  WJ124-3.81-2P  [CONN-TH_2P-P3.81_KF124-3.81-2P]
INPUT2  WJ124-3.81-2P  [CONN-TH_2P-P3.81_KF124-3.81-2P]
INPUT3  WJ124-3.81-2P  [CONN-TH_2P-P3.81_KF124-3.81-2P]
OC1  PC817X2CSP9F  [SMD-4_L4.6-W6.5-P2.54-LS10.2-TL]
OC2  PC817X2CSP9F  [SMD-4_L4.6-W6.5-P2.54-LS10.2-TL]
OC3  PC817X2CSP9F  [SMD-4_L4.6-W6.5-P2.54-LS10.2-TL]
OC4  PC817X2CSP9F  [SMD-4_L4.6-W6.5-P2.54-LS10.2-TL]
QR1  AO3400A  [SOT-23-3_L2.9-W1.6-P1.90-LS2.8-BR]
QR2  AO3400A  [SOT-23-3_L2.9-W1.6-P1.90-LS2.8-BR]
QR3  AO3400A  [SOT-23-3_L2.9-W1.6-P1.90-LS2.8-BR]
QR4  AO3400A  [SOT-23-3_L2.9-W1.6-P1.90-LS2.8-BR]
QR5  AO3400A  [SOT-23-3_L2.9-W1.6-P1.90-LS2.8-BR]
QR6  AO3400A  [SOT-23-3_L2.9-W1.6-P1.90-LS2.8-BR]
QR7  AO3400A  [SOT-23-3_L2.9-W1.6-P1.90-LS2.8-BR]
R15  1.2kΩ  [R0805]
R16  3.3kΩ  [R0805]
R17  3.3kΩ  [R0805]
R18  1.2kΩ  [R0805]
R19  3.3kΩ  [R0805]
R20  1.2kΩ  [R0805]
R23  3.3kΩ  [R0805]
R24  1.2kΩ  [R0805]
R25  10kΩ  [R0603]
RL1  HFD4/5-S  [RELAY-SMD_HFD4-5-SR]
RL2  HFD4/5-S  [RELAY-SMD_HFD4-5-SR]
RL3  HFD4/5-S  [RELAY-SMD_HFD4-5-SR]
RL4  HFD4/5-S  [RELAY-SMD_HFD4-5-SR]
RL5  HFD4/5-S  [RELAY-SMD_HFD4-5-SR]
RL6  SRD-05VDC-SL-C  [RELAY-TH_SRD-XXVDC-XL-C]
RL7  SRD-05VDC-SL-C  [RELAY-TH_SRD-XXVDC-XL-C]
SW0  WJ124-3.81-3P  [CONN-TH_3P-P3.81_WJ124-3.81-3P]
SW1  WJ124-3.81-3P  [CONN-TH_3P-P3.81_WJ124-3.81-3P]
SW2  WJ124-3.81-3P  [CONN-TH_3P-P3.81_WJ124-3.81-3P]
SW3  WJ124-3.81-3P  [CONN-TH_3P-P3.81_WJ124-3.81-3P]
SW4  WJ124-3.81-3P  [CONN-TH_3P-P3.81_WJ124-3.81-3P]
SW5  WJ500V-5.08-3P-14-00A  [CONN-TH_3P-P5.00_WJ500V-5.08-3P]
SW6  WJ500V-5.08-3P-14-00A  [CONN-TH_3P-P5.00_WJ500V-5.08-3P]
U5  MCP23017-E/SO  [SOIC-28_L18.0-W7.5-P1.27-LS10.3-BL]
sheet Power Supply
C13  220uF  [CAP-SMD_BD10.0-L10.3-W10.3-FD]
C14  100nF  [C0805]
C32  220uF  [CAP-SMD_BD10.0-L10.3-W10.3-FD]
C33  100nF  [C0805]
C34  220uF  [CAP-SMD_BD10.0-L10.3-W10.3-FD]
C35  100nF  [C0805]
C55  100nF  [C0805]
C56  220uF  [CAP-SMD_BD10.0-L10.3-W10.3-FD]
C57  100nF  [C0805]
C58  100nF  [C0805]
C59  220uF  [CAP-SMD_BD10.0-L10.3-W10.3-FD]
C60  220uF  [CAP-SMD_BD10.0-L10.3-W10.3-FD]
D5  SS54  [SMC_L7.1-W6.2-LS8.1-RD]
D7  SS54  [SMC_L7.1-W6.2-LS8.1-RD]
D8  SS54  [SMC_L7.1-W6.2-LS8.1-RD]
D11  SS54  [SMC_L7.1-W6.2-LS8.1-RD]
L1  33uH  [IND-SMD_L6.8-W6.8_SMMS0630]
L2  33uH  [IND-SMD_L6.8-W6.8_SMMS0630]
L5  33uH  [IND-SMD_L6.8-W6.8_SMMS0630]
L6  33uH  [IND-SMD_L6.8-W6.8_SMMS0630]
PWR  WJ500V-5.08-2P-14-00A  [CONN-TH_2P-P5.00_WJ500V-5.08-2P]
U8  LM2596S-5.0/TR  [TO-263-5_L10.2-W8.6-P1.70-LS14.4-TL]
U9  LM2596S-5.0/TR  [TO-263-5_L10.2-W8.6-P1.70-LS14.4-TL]
sheet PWM
C49  100nF  [C0805]
FU11  BSMD0805-050-24V  [F0805]
FU12  BSMD0805-050-24V  [F0805]
FU13  BSMD0805-050-24V  [F0805]
FU14  BSMD0805-050-24V  [F0805]
FU16  BSMD0805-050-24V  [F0805]
FU17  BSMD0805-050-24V  [F0805]
FU18  BSMD0805-050-24V  [F0805]
FU19  BSMD0805-050-24V  [F0805]
FU20  BSMD0805-050-24V  [F0805]
FU21  BSMD0805-050-24V  [F0805]
FU22  BSMD0805-050-24V  [F0805]
FU23  BSMD0805-050-24V  [F0805]
FU24  BSMD0805-050-24V  [F0805]
FU25  BSMD0805-050-24V  [F0805]
FU26  BSMD0805-050-24V  [F0805]
FU115  BSMD0805-050-24V  [F0805]
PWM01  WJ124-3.81-4P  [CONN-TH_4P-P3.81_KF124-3.81-4P]
PWM23  WJ124-3.81-4P  [CONN-TH_4P-P3.81_KF124-3.81-4P]
PWM45  WJ124-3.81-4P  [CONN-TH_4P-P3.81_KF124-3.81-4P]
PWM67  WJ124-3.81-4P  [CONN-TH_4P-P3.81_KF124-3.81-4P]
PWR-PWM  WJ500V-5.08-2P-14-00A  [CONN-TH_2P-P5.00_WJ500V-5.08-2P]
QL1  AO3400A  [SOT-23-3_L2.9-W1.6-P1.90-LS2.8-BR]
QL2  AO3400A  [SOT-23-3_L2.9-W1.6-P1.90-LS2.8-BR]
QL3  AO3400A  [SOT-23-3_L2.9-W1.6-P1.90-LS2.8-BR]
QL4  AO3400A  [SOT-23-3_L2.9-W1.6-P1.90-LS2.8-BR]
QL5  AO3400A  [SOT-23-3_L2.9-W1.6-P1.90-LS2.8-BR]
QL6  AO3400A  [SOT-23-3_L2.9-W1.6-P1.90-LS2.8-BR]
QL7  AO3400A  [SOT-23-3_L2.9-W1.6-P1.90-LS2.8-BR]
QL8  AO3400A  [SOT-23-3_L2.9-W1.6-P1.90-LS2.8-BR]
R7  10kΩ  [R0805]
U1  PCA9685PW,118  [TSSOP-28_L9.7-W4.4-P0.65-LS6.4-TL]
sheet Sensor
C50  100nF  [C0805]
C51  2.2uF  [C0805]
C52  100nF  [C0805]
C53  2.2uF  [C0805]
F3  BSMD0805-050-24V  [F0805]
FS1  BSMD0805-005-60V  [R0805]
FS2  BSMD0805-005-60V  [R0805]
FS3  BSMD0805-005-60V  [R0805]
FS4  BSMD0805-005-60V  [R0805]
FS5  BSMD0805-005-60V  [R0805]
FS6  BSMD0805-005-60V  [R0805]
FS7  BSMD0805-005-60V  [R0805]
FS8  BSMD0805-005-60V  [R0805]
FS9  BSMD0805-005-60V  [R0805]
FS10  BSMD0805-005-60V  [R0805]
FS11  BSMD0805-005-60V  [R0805]
FS12  BSMD0805-005-60V  [R0805]
FS13  BSMD0805-005-60V  [R0805]
FS14  BSMD0805-005-60V  [R0805]
FS15  BSMD0805-005-60V  [R0805]
R8  330Ω  [R0805]
R9  330Ω  [R0805]
R10  330Ω  [R0805]
R11  330Ω  [R0805]
R12  330Ω  [R0805]
R13  330Ω  [R0805]
SEN0  WJ124-3.81-2P  [CONN-TH_2P-P3.81_KF124-3.81-2P]
SEN1  WJ124-3.81-2P  [CONN-TH_2P-P3.81_KF124-3.81-2P]
SEN2  WJ124-3.81-2P  [CONN-TH_2P-P3.81_KF124-3.81-2P]
SEN3  WJ124-3.81-2P  [CONN-TH_2P-P3.81_KF124-3.81-2P]
SEN4  WJ124-3.81-2P  [CONN-TH_2P-P3.81_KF124-3.81-2P]
SEN5  WJ124-3.81-2P  [CONN-TH_2P-P3.81_KF124-3.81-2P]
SEN6  WJ124-3.81-3P  [CONN-TH_3P-P3.81_WJ124-3.81-3P]
U2  ADS7830IPWR  [TSSOP-16_L5.0-W4.4-P0.65-LS6.4-BL]
U3  REF3033AIDBZR  [SOT-23-3_L3.0-W1.7-P0.95-LS2.9-BR]
U4  OPA2330AIDR  [SOIC-8_L4.9-W3.9-P1.27-LS6.0-BL]  (sections 1,2)
sheet UART
C1  4.7uF  [C0805]
C3  100nF  [C0603]
C4  4.7uF  [C0805]
C6  100nF  [C0603]
C8  4.7uF  [C0805]
C12  15pF  [C0603]
C15  15pF  [C0603]
C26  100nF  [C0805]
C27  100nF  [C0805]
C28  100nF  [C0805]
C29  100nF  [C0805]
C30  100nF  [C0805]
C31  100nF  [C0805]
C36  4.7uF  [C0805]
C37  100nF  [C0603]
C38  4.7uF  [C0805]
C39  100nF  [C0603]
C40  4.7uF  [C0805]
C41  15pF  [C0603]
C42  15pF  [C0603]
C43  100nF  [C0805]
C44  100nF  [C0805]
C45  100nF  [C0805]
C46  100nF  [C0805]
C47  100nF  [C0805]
C48  100nF  [C0805]
C61  100nF  [C0603]
C62  4.7uF  [C0805]
C63  10uF  [C0805]
C64  10uF  [C0805]
C65  10uF  [C0805]
C66  10uF  [C0805]
H1  GP26-2520WV-3P  [HDR-TH_3P-P2.54-V-M]
H2  GP26-2520WV-3P  [HDR-TH_3P-P2.54-V-M]
H3  GP26-2520WV-3P  [HDR-TH_3P-P2.54-V-M]
H4  GP26-2520WV-3P  [HDR-TH_3P-P2.54-V-M]
H5  GP26-2520WV-3P  [HDR-TH_3P-P2.54-V-M]
H6  GP26-2520WV-3P  [HDR-TH_3P-P2.54-V-M]
R3  2.7K  [R0603]
R6  2.7K  [R0603]
U12  FE1.1S  [SSOP-28_L9.9-W3.9-P0.64-LS6.0-BL]
U13  FE1.1S  [SSOP-28_L9.9-W3.9-P0.64-LS6.0-BL]
U14  PL2303GL  [SOP-8_L4.9-W3.9-P1.27-LS6.0-BL]
U15  ADUM121N1BRZ-RL7  [SOIC-8_L4.9-W3.9-P1.27-LS6.0-BL]
U16  PL2303GL  [SOP-8_L4.9-W3.9-P1.27-LS6.0-BL]
U17  ADUM121N1BRZ-RL7  [SOIC-8_L4.9-W3.9-P1.27-LS6.0-BL]
U18  PL2303GL  [SOP-8_L4.9-W3.9-P1.27-LS6.0-BL]
U19  ADUM121N1BRZ-RL7  [SOIC-8_L4.9-W3.9-P1.27-LS6.0-BL]
U20  PL2303GL  [SOP-8_L4.9-W3.9-P1.27-LS6.0-BL]
U21  ADUM121N1BRZ-RL7  [SOIC-8_L4.9-W3.9-P1.27-LS6.0-BL]
U22  PL2303GL  [SOP-8_L4.9-W3.9-P1.27-LS6.0-BL]
U23  ADUM121N1BRZ-RL7  [SOIC-8_L4.9-W3.9-P1.27-LS6.0-BL]
U24  PL2303GL  [SOP-8_L4.9-W3.9-P1.27-LS6.0-BL]
U25  ADUM121N1BRZ-RL7  [SOIC-8_L4.9-W3.9-P1.27-LS6.0-BL]
U26  B0505D-1WR2  [PWRM-TH_BXXXXD-1WR2]
U27  AMS1117-3.3  [SOT-223-3_L6.5-W3.4-P2.30-LS7.0-BR]
UART0  WJ124-3.81-3P  [CONN-TH_3P-P3.81_WJ124-3.81-3P]
UART1  WJ124-3.81-3P  [CONN-TH_3P-P3.81_WJ124-3.81-3P]
UART2  WJ124-3.81-3P  [CONN-TH_3P-P3.81_WJ124-3.81-3P]
UART3  WJ124-3.81-3P  [CONN-TH_3P-P3.81_WJ124-3.81-3P]
UART4  WJ124-3.81-3P  [CONN-TH_3P-P3.81_WJ124-3.81-3P]
UART5  WJ124-3.81-3P  [CONN-TH_3P-P3.81_WJ124-3.81-3P]
X2  12MHz  [OSC-SMD_4P-L3.2-W2.5-BL]
X5  12MHz  [OSC-SMD_4P-L3.2-W2.5-BL]
sheet USB
C7  15pF  [C0603]
C9  15pF  [C0603]
C10  4.7uF  [C0805]
C11  100nF  [C0603]
C16  4.7uF  [C0805]
C17  100nF  [C0603]
C18  15pF  [C0603]
C19  4.7uF  [C0805]
C20  15pF  [C0603]
C21  4.7uF  [C0805]
C22  100nF  [C0603]
C23  4.7uF  [C0805]
C24  100nF  [C0603]
C25  4.7uF  [C0805]
D1  USBLC6-2SC6  [SOT-23-6_L2.9-W1.6-P0.95-LS2.8-BR]
D2  USBLC6-2SC6  [SOT-23-6_L2.9-W1.6-P0.95-LS2.8-BR]
D3  USBLC6-2SC6  [SOT-23-6_L2.9-W1.6-P0.95-LS2.8-BR]
D4  USBLC6-2SC6  [SOT-23-6_L2.9-W1.6-P0.95-LS2.8-BR]
D9  USBLC6-2SC6  [SOT-23-6_L2.9-W1.6-P0.95-LS2.8-BR]
D10  USBLC6-2SC6  [SOT-23-6_L2.9-W1.6-P0.95-LS2.8-BR]
FU1  BSMD0805-050-24V  [F0805]
FU2  BSMD0805-050-24V  [F0805]
FU3  BSMD0805-050-24V  [F0805]
FU4  BSMD0805-050-24V  [F0805]
FU9  BSMD0805-050-24V  [F0805]
FU10  BSMD0805-050-24V  [F0805]
R2  2.7K  [R0603]
R4  2.7K  [R0603]
U10  FE1.1S  [SSOP-28_L9.9-W3.9-P0.64-LS6.0-BL]
U11  FE1.1S  [SSOP-28_L9.9-W3.9-P0.64-LS6.0-BL]
USB1  U221-041N-1BU07-S1  [MINI-USB-SMD_U221-041N-1BU07-S1]
USB2  U221-041N-1BU07-S1  [MINI-USB-SMD_U221-041N-1BU07-S1]
USB3  U221-041N-1BU07-S1  [MINI-USB-SMD_U221-041N-1BU07-S1]
USB4  U221-041N-1BU07-S1  [MINI-USB-SMD_U221-041N-1BU07-S1]
USB_S34  USB-269-BRW  [USB-A-TH_USB-269-BRW]
USB_SW  PZ254V-12-4P  [HDR-TH_4P-P2.54-V-M-R2-C2-S2.54]
X1  12MHz  [OSC-SMD_4P-L3.2-W2.5-BL]
X4  12MHz  [OSC-SMD_4P-L3.2-W2.5-BL]

## Library data of the parts
ACTIVE = 0805G (Green): Supplier: LCSC; Manufacturer: KENTO; Supplier Part: C2297; JLCPCB Part Class: Basic Part
BAT = CR1220-2ZX: Supplier: LCSC; Supplier Part: C969906; Manufacturer: Q&J; Contributor: LCSC; Paste Type: Extended Part; JLCPCB Part Class: Extended Part
C2 C5 C14 C26-C31 C33 C35 C43-C50 C52 C55 C57 C58 C67-C72 = CC0805KRX7R9BB104: Supplier: LCSC; Manufacturer: YAGEO; Supplier Part: C49678; JLCPCB Part Class: Basic Part
CN1 CN2 = DF40HC(3.0)-100DS-0.4V(51): Supplier: LCSC; Supplier Part: C424649; Manufacturer: HRS(广濑); Contributor: LCSC; JLCPCB Part Class: Extended Part
D6 DR1-DR7 = B5819W_C8598: Supplier: LCSC; Manufacturer: CJ; Supplier Part: C8598; JLCPCB Part Class: Basic Part
F1-F3 FU1-FU4 FU9-FU14 FU16-FU26 FU115 = BSMD0805-050-24V: Supplier: LCSC; Supplier Part: C910822; Manufacturer: BHFUSE; Contributor: LCSC; JLCPCB Part Class: Extended Part
F4 F5 FI1-FI8 FIN1-FIN8 FS1-FS15 = BSMD0805-005-60V: Supplier: LCSC; Supplier Part: C960019; Manufacturer: BHFUSE; Contributor: LCSC; JLCPCB Part Class: Extended Part
GPIO SETTING = PZ254V-12-8P: Supplier: LCSC; Supplier Part: C492421; Manufacturer: XFCN; Contributor: LCSC; JLCPCB Part Class: Extended Part
HDMI = HDMI-019S: Supplier: LCSC; Manufacturer: SOFNG; Supplier Part: C111617
I2C_1 I2C_2 = B4B-XH-A(LF)(SN): Supplier: LCSC; Supplier Part: C144395; Manufacturer: JST Sales America; Contributor: LCSC; JLCPCB Part Class: Extended Part
IRLED = B2B-XH-A (LF)(SN): Supplier: LCSC; Supplier Part: C158012; Manufacturer: JST; Manufacturer Part: B2B-XH-A(LF)(SN); Contributor: LCSC; JLCPCB Part Class: Extended Part
POWER = 17-21SUYC/TR8: Supplier: LCSC; Manufacturer: KENTO; Supplier Part: C2296; JLCPCB Part Class: Basic Part
QL1-QL8 QR1-QR8 = AO3400A: Supplier: LCSC; Manufacturer: AOS; Supplier Part: C20917; JLCPCB Part Class: Basic Part
R1 R5 = 0603WAF5101T5E: Supplier: LCSC; Manufacturer: UniOhm; Supplier Part: C23186; Resistance (Ohms): 5.1K; JLCPCB Part Class: Basic Part
R14 = 0805W8F1200T5E: Supplier: LCSC; Manufacturer: UNI-ROYAL(厚声); Supplier Part: C17437; Resistance (Ohms): 120; JLCPCB Part Class: Basic Part
R21 R22 = 0805W8F3300T5E: Supplier: LCSC; Manufacturer: UniOhm; Supplier Part: C17630; JLCPCB Part Class: Basic Part
U6 = DS1307Z+T&amp;amp;R: Supplier: LCSC; Manufacturer: MAXIM; Supplier Part: C9868; JLCPCB Part Class: Extended Part
U7 = 24LC08BT-I/SN SOP-8: Supplier: LCSC; Manufacturer: MICROCHIP; Supplier Part: C5455; JLCPCB Part Class: Extended Part
USB_DBG = USB3.1C16PFSMT: Supplier: LCSC; Supplier Part: C167321; Manufacturer: LCSC; Contributor: LCSC; JLCPCB Part Class: Extended Part
X3 = S3132768092070: Supplier: LCSC; Supplier Part: C479190; Manufacturer: JGHC; Contributor: LCSC; JLCPCB Part Class: Extended Part
ZYMKEY4 = 210S-2*5P L=11.6MMGold-plated black: Supplier: LCSC; Manufacturer: Ckmtw; Contributor: LCSC; Supplier Part: C124387; JLCPCB Part Class: Extended Part
C3 C6 C11 C17 C22 C24 C37 C39 C54 C61 = CC0603KRX7R9BB104: Supplier: LCSC; Manufacturer: YAGEO; Supplier Part: C14663; JLCPCB Part Class: Basic Part
INPUT0-INPUT3 SEN0-SEN5 = WJ124-3.81-2P: Supplier: LCSC; Manufacturer: ReliaPro; Supplier Part: C69811; JLCPCB Part Class: Extended Part
OC1-OC4 = PC817X2CSP9F: Supplier: LCSC; Manufacturer: SHARP; Supplier Part: C66405; JLCPCB Part Class: Extended Part
R15 R18 R20 R24 = 0805W8F1201T5E: Supplier: LCSC; Manufacturer: UniOhm; Supplier Part: C17379; Resistance (Ohms): 1.2K; JLCPCB Part Class: Basic Part
R16 R17 R19 R23 = 0805W8F3301T5E: Supplier: LCSC; Manufacturer: UniOhm; Supplier Part: C26010; Resistance (Ohms): 3.3K; JLCPCB Part Class: Basic Part
R25 = 0603WAF1002T5E: Supplier: LCSC; Manufacturer: UniOhm; Supplier Part: C25804; Resistance (Ohms): 10K; JLCPCB Part Class: Basic Part
RL1-RL5 = HFD4/5-S: Supplier: LCSC; Manufacturer: HF(宏发); Manufacturer Part: HFD4/5-SR; Supplier Part: C64399; JLCPCB Part Class: Extended Part
RL6 RL7 = SRD-05VDC-SL-C: Supplier: LCSC; Manufacturer: SONGLE; Supplier Part: C35449; JLCPCB Part Class: Extended Part
SEN6 SW0-SW4 UART0-UART5 = WJ124-3.81-3P: Supplier: LCSC; Manufacturer: KANGNEX(康奈克斯电气); Supplier Part: C36780; JLCPCB Part Class: Extended Part
SW5 SW6 = WJ500V-5.08-3P-14-00A: Supplier: LCSC; Manufacturer: ReliaPro; Supplier Part: C72334; JLCPCB Part Class: Extended Part
U5 = MCP23017-E/SO: Supplier: LCSC; Manufacturer: MICROCHIP(美国微芯); Contributor: LCSC; Supplier Part: C47023; JLCPCB Part Class: Extended Part
C13 C32 C34 C56 C59 C60 = VEJ221M1V1010-TRO: Supplier: LCSC; Supplier Part: C249622; Manufacturer: Lelon; Contributor: LCSC; JLCPCB Part Class: Extended Part
D5 D7 D8 D11 = SS54_C16103: Supplier: LCSC; Manufacturer: MDD; Supplier Part: C16103; JLCPCB Part Class: Extended Part
L1 L2 L5 L6 = SMMS0630-330M: Supplier: LCSC; Manufacturer: SXN; Supplier Part: C149577; JLCPCB Part Class: Extended Part
PWR PWR-PWM = WJ500V-5.08-2P-14-00A: Supplier: LCSC; Manufacturer: ReliaPro; Supplier Part: C8465; JLCPCB Part Class: Extended Part
U8 U9 = LM2596S-5.0/TR: Supplier: LCSC; Supplier Part: C194349; Manufacturer: HGSEMI; Contributor: LCSC; JLCPCB Part Class: Extended Part
PWM01 PWM23 PWM45 PWM67 = WJ124-3.81-4P: Supplier: LCSC; Manufacturer: ReliaPro; Supplier Part: C69809; JLCPCB Part Class: Extended Part
R7 = 0805W8F1002T5E: Supplier: LCSC; Manufacturer: UniOhm; Supplier Part: C17414; Resistance (Ohms): 10K; JLCPCB Part Class: Basic Part
U1 = PCA9685PW,118: Supplier: LCSC; Supplier Part: C2678753; Manufacturer: NXP(恩智浦); link: https://atta.szlcsc.com//upload/public/pdf/source/20170908/C92206_1504870161626958140.pdf; JLCPCB Part Class: Extended Part; Contributor: LCSC
C51 C53 = 0805F225M500NT: Supplier: LCSC; Manufacturer: FH(风华); Supplier Part: C49217; JLCPCB Part Class: Basic Part
R8-R13 = TC0525B3300T5E: Supplier: LCSC; Manufacturer: UniOhm; Resistance (Ohms): 330; Supplier Part: C44794; JLCPCB Part Class: Extended Part
U2 = ADS7830IPWR: Supplier: LCSC; Manufacturer: TI(德州仪器); Contributor: LCSC; Supplier Part: C161747; JLCPCB Part Class: Extended Part
U3 = REF3033AIDBZR: Supplier: LCSC; Manufacturer: TI(德州仪器); Supplier Part: C36658; JLCPCB Part Class: Extended Part
U4 = OPA2330AIDR: Supplier Part: C128746; Supplier: LCSC; Manufacturer: TI; subpart_no: 2; JLCPCB Part Class: Extended Part
C1 C4 C8 C10 C16 C19 C21 C23 C25 C36 C38 C40 C62 = CL21A475KAQNNNE: Supplier: LCSC; Manufacturer: SAMSUNG; Supplier Part: C1779; JLCPCB Part Class: Basic Part
C7 C9 C12 C15 C18 C20 C41 C42 = CL10C150JB8NNNC: Supplier: LCSC; Manufacturer: SAMSUNG; Supplier Part: C1644; JLCPCB Part Class: Basic Part
C63-C66 = CL21A106KAYNNNE: Supplier: LCSC; Manufacturer: SAMSUNG; Supplier Part: C15850; JLCPCB Part Class: Basic Part
H1-H6 = GP26-2520WV-3P: Supplier: LCSC; Supplier Part: C2681738; Manufacturer: GEPU(歌普); Contributor: LCSC; JLCPCB Part Class: Extended Part
R2-R4 R6 = 0603WAF2701T5E: Supplier: LCSC; Manufacturer: UniOhm; Supplier Part: C13167; JLCPCB Part Class: Basic Part
U10-U13 = FE1.1S: Supplier: LCSC; Manufacturer: TERMINUS; Supplier Part: C9359; JLCPCB Part Class: Extended Part
U14 U16 U18 U20 U22 U24 = PL2303GL: Supplier: LCSC; Supplier Part: C2905408; Manufacturer: PROLIFIC(旺玖); Contributor: LCSC; JLCPCB Part Class: Extended Part
U15 U17 U19 U21 U23 U25 = ADUM121N1BRZ-RL7: Supplier: LCSC; Supplier Part: C190783; Manufacturer: Analog Devices; Contributor: LCSC; JLCPCB Part Class: Extended Part
U26 = B0505D-1WR2: Supplier: LCSC; Manufacturer: MORNSUN; Supplier Part: C40604; JLCPCB Part Class: Extended Part
U27 = AMS1117-3.3: sourceId: dwIGgezVh; Supplier: LCSC; Manufacturer: AMS; Supplier Part: C6186; JLCPCB Part Class: Basic Part
X1 X2 X4 X5 = X322512MSB4SI: Supplier: LCSC; Manufacturer: YXC; Supplier Part: C9002; Paste Type: Basic Part; JLCPCB Part Class: Basic Part
D1-D4 D9 D10 = USBLC6-2SC6: Supplier: LCSC; Manufacturer: STMicroelectronics; Supplier Part: C7519; JLCPCB Part Class: Extended Part
USB1-USB4 = U221-041N-1BU07-S1: Supplier: LCSC; Supplier Part: C2682184; Manufacturer: XKB Connectivity; Contributor: LCSC; JLCPCB Part Class: Extended Part
USB_S34 = USB-269-BRW: Supplier: LCSC; Supplier Part: C720548; Manufacturer: XUNPU; Contributor: LCSC; JLCPCB Part Class: Extended Part
USB_SW = PZ254V-12-4P: Supplier: LCSC; Supplier Part: C492419; Manufacturer: XFCN; Contributor: LCSC; JLCPCB Part Class: Extended Part

## Nets
3V3: C49.2 C50.2 C54.2 F2.2 R16.2 R17.2 R19.2 R23.2 R25.1 U1.28(VDD) U2.16(+VDD) U5.9(VDD)
3V3_UART: C64.2 C66.2 H1.3 H2.3 H3.3 H4.3 H5.3 H6.3 U27.2(VOUT) U27.4(VOUT)
3V3REF: C51.2 U2.10(REFIN/REFOUT) U3.2(OUT) U4.3(IN A+) U4.5(IN B+)
3V3REF_A: R8.2 R9.2 R10.2 R11.2 U4.1(OUT A) U4.2(IN A-)
3V3REF_B: R12.2 R13.2 U4.6(IN B-) U4.7(OUT B)
+5V: C1.2 C5.2 C19.2 C25.2 C27.2 C29.2 C31.2 C34.1 C35.2 C36.2 C43.2 C45.2 C47.2 C52.1 C53.1 C61.1 C62.1 C67.2 C68.2 C69.2 C70.2 CN1.57 CN1.58 CN1.59 CN1.60 CN1.61 CN1.62 D6.2(+) DR1.1(-) DR2.1(-) DR3.1(-) DR4.1(-) DR5.1(-) DR6.1(-) DR7.1(-) FI1.2 FI8.2 FS13.2 GPIO.5 GPIO.7 L6.2 R14.1 RL1.8 RL2.8 RL3.8 RL4.8 RL5.8 RL6.1 RL7.1 U3.1(IN) U4.8(V+) U6.8(VCC) U10.20(VDD5) U11.20(VDD5) U12.20(VDD5) U13.20(VDD5) U14.3(VDD_IO) U14.7(VIN) U15.1(VDD1) U16.3(VDD_IO) U16.7(VIN) U17.1(VDD1) U18.3(VDD_IO) U18.7(VIN) U19.1(VDD1) U20.3(VDD_IO) U20.7(VIN) U21.1(VDD1) U22.3(VDD_IO) U22.7(VIN) U23.1(VDD1) U24.3(VDD_IO) U24.7(VIN) U25.1(VDD1) U26.4(VIN) USB_DBG.A4(VBUS) USB_DBG.A9(VBUS) ZYMKEY4.2 ZYMKEY4.4
+5V_HDMI: F1.2 HDMI.18(+5V)
+5V_UART: C63.2 C65.2 H1.1 H2.1 H3.1 H4.1 H5.1 H6.1 U26.5(+VO) U27.3(VIN)
+5V_UP: C58.2 C60.1 D1.5 D2.5 D3.5 D4.5 D9.5 D10.5 FU1.2 FU2.2 FU3.2 FU4.2 FU9.2 FU10.2 L2.2
AGND: C51.1 C53.2 F3.2 FS2.2 FS3.2 FS5.2 FS7.2 FS10.2 FS12.2 FS15.2 U2.11(COM) U3.3(GND) U4.4(V-)
GND: BAT.2 C1.1 C2.1 C3.1 C4.1 C5.1 C6.1 C7.2 C8.1 C9.1 C10.1 C11.1 C12.1 C13.2 C14.1 C15.2 C16.1 C17.1 C18.2 C19.1 C20.1 C21.1 C22.1 C23.1 C24.1 C25.1 C27.1 C29.1 C31.1 C32.2 C33.1 C34.2 C35.1 C36.1 C37.1 C38.1 C39.1 C40.1 C41.1 C42.2 C43.1 C45.1 C47.1 C49.1 C50.1 C52.2 C54.1 C55.1 C56.2 C57.1 C58.1 C59.2 C60.2 C61.2 C62.2 C67.1 C68.1 C69.1 C70.1 C71.1 C72.1 CN1.1 CN1.4 CN1.7 CN1.11 CN1.16 CN1.21 CN1.26 CN1.30 CN1.33 CN1.37 CN1.49 CN1.65 CN1.68 CN1.71 CN1.74 CN1.79 CN1.84 CN1.89 CN1.94 CN1.97 CN1.100 CN2.4 CN2.7 CN2.10 CN2.13 CN2.16 CN2.19 CN2.22 CN2.25 CN2.28 CN2.31 CN2.34 CN2.37 CN2.40 CN2.43 CN2.46 CN2.49 CN2.52 CN2.55 CN2.58 CN2.61 CN2.64 CN2.67 CN2.70 CN2.73 CN2.82 CN2.85 CN2.88 CN2.91 CN2.94 CN2.97 D1.2 D2.2 D3.2 D4.2 D5.1(A) D7.1(A) D9.2 D10.2 F3.1 FI2.2 FI7.2 GPIO.1 GPIO.3 HDMI.2(D2_SHIELD) HDMI.5(D1_SHIELD) HDMI.8(D0_SHIELD) HDMI.11(CK_SHIELD) HDMI.17(GND) HDMI.20(SHD) HDMI.21(SHD) HDMI.22(SHD) HDMI.23(SHD) OC1.3 OC2.3 OC3.3 OC4.3 PWR.1 PWR-PWM.1 QL1.2(S) QL2.2(S) QL3.2(S) QL4.2(S) QL5.2(S) QL6.2(S) QL7.2(S) QL8.2(S) QR1.2(S) QR2.2(S) QR3.2(S) QR4.2(S) QR5.2(S) QR6.2(S) QR7.2(S) QR8.2(S) R1.2 R2.1 R3.1 R4.1 R5.1 R6.1 R7.2 SETTING.2 SETTING.4 SETTING.6 SETTING.8 U1.1(A0) U1.2(A1) U1.3(A2) U1.4(A3) U1.5(A4) U1.14(VSS) U1.24(A5) U1.25(EXTCLK) U2.9(GND) U2.12(A0) U2.13(A1) U5.10(VSS) U5.15(A0) U5.16(A1) U5.17(A2) U6.4(GND) U7.1(A0) U7.2(A1) U7.3(A2) U7.4(VSS) U7.7(WP) U8.3(GND) U8.5(ON#/OFF) U8.6(GND) U9.3(GND) U9.5(ON#/OFF) U9.6(GND) U10.1(VSS) U11.1(VSS) U12.1(VSS) U13.1(VSS) U14.1(GND) U15.4(GND1) U16.1(GND) U17.4(GND1) U18.1(GND) U19.4(GND1) U20.1(GND) U21.4(GND1) U22.1(GND) U23.4(GND1) U24.1(GND) U25.4(GND1) U26.1(GND) USB1.4(GND) USB1.5(EH) USB2.4(GND) USB2.5(EH) USB3.4(GND) USB3.5(EH) USB4.4(GND) USB4.5(EH) USB_DBG.0 USB_DBG.A1(GND) USB_DBG.A12(GND) USB_S34.4(GND) USB_S34.8(GND) USB_S34.9(GND) USB_S34.10(GND) USB_S34.11(GND) USB_S34.12(GND) X1.2(GND) X1.4(GND) X2.2(GND) X2.4(GND) X4.2(GND) X4.4(GND) X5.2(GND) X5.4(GND) ZYMKEY4.6 ZYMKEY4.9
GND_UART: C26.1 C28.1 C30.1 C44.1 C46.1 C48.1 C63.1 C64.1 C65.1 C66.1 U15.5(GND2) U17.5(GND2) U19.5(GND2) U21.5(GND2) U23.5(GND2) U25.5(GND2) U26.7(0V) U27.1(GND) UART0.2 UART1.2 UART2.2 UART3.2 UART4.2 UART5.2
PVCC: D8.1(A) D11.1(A) PWR.2
CM4_1V8: CN1.44 CN1.45
CM4_3V3: ACTIVE.2(A) C2.2 C71.2 C72.2 CN1.39 CN1.42 CN1.43 F2.1 POWER.2(+) U7.8(VCC) ZYMKEY4.1
EEPROM_nWP: CN1.10 SETTING.5
GLOBAL_EN: CN1.51 SETTING.1
GPIO4: CN1.27 ZYMKEY4.7
GPIO5: CN1.17 U5.20(INTA)
GPIO6: CN1.15 U5.19(INTB)
GPIO7: CN1.82 R25.2 U5.18(RESET#)
GPIO12: CN1.85 GPIO.2
GPIO14: CN1.73 ZYMKEY4.8
GPIO15: CN1.75 ZYMKEY4.10
GPIO18: CN1.76 QR8.1(G)
GPIO19: CN1.13 GPIO.8
GPIO21: CN1.88 GPIO.6
GPIO27: CN1.24 GPIO.4
HDMI0_CEC: CN2.75 HDMI.13(CEC)
HDMI0_CLK_N: CN2.45 HDMI.12(CK-)
HDMI0_CLK_P: CN2.44 HDMI.10(CK+)
HDMI0_HPD: CN2.74 HDMI.19(HOT_PLUG_DET)
HDMI0_SCL: CN2.50 HDMI.15(I2C-CLK)
HDMI0_SDA: CN2.51 HDMI.16(I2C_DATA)
HDMI0_TX0_N: CN2.42 HDMI.9(D0-)
HDMI0_TX0_P: CN2.41 HDMI.7(D0+)
HDMI0_TX1_N: CN2.39 HDMI.6(D1-)
HDMI0_TX1_P: CN2.38 HDMI.4(D1+)
HDMI0_TX2_N: CN2.36 HDMI.3(D2-)
HDMI0_TX2_P: CN2.35 HDMI.1(D2+)
INPUT0: OC1.4 R16.1 U5.21(GPA0)
INPUT1: OC2.4 R17.1 U5.22(GPA1)
INPUT2: OC3.4 R19.1 U5.23(GPA2)
INPUT3: OC4.4 R23.1 U5.24(GPA3)
LVCC: FU11.1 FU13.1 FU17.1 FU19.1 FU21.1 FU23.1 FU25.1 FU115.1 PWR-PWM.2
nRPIBOOT: CN1.54 SETTING.3
Pi_LED_nACT: CN1.90 R21.2
Pi_LED_nPWR: CN1.53 R22.2
PWM0: QL1.1(G) U1.6(LED0)
PWM1: QL2.1(G) U1.7(LED1)
PWM2: QL3.1(G) U1.8(LED2)
PWM3: QL4.1(G) U1.9(LED3)
PWM4: QL5.1(G) U1.10(LED4)
PWM5: QL6.1(G) U1.11(LED5)
PWM6: QL7.1(G) U1.12(LED6)
PWM7: QL8.1(G) U1.13(LED7)
RELAY0: QR1.1(G) U5.1(GPB0)
RELAY1: QR2.1(G) U5.2(GPB1)
RELAY2: QR3.1(G) U5.3(GPB2)
RELAY3: QR4.1(G) U5.4(GPB3)
RELAY4: QR5.1(G) U5.5(GPB4)
RELAY5: QR6.1(G) U5.6(GPB5)
RELAY6: QR7.1(G) U5.7(GPB6)
SCL: CN1.28 FI3.2 FI6.2 U1.26(SCL) U2.14(SCL) U5.12(SCL) U6.6(SCL) U7.6(SCL) ZYMKEY4.5
SDA: CN1.29 FI4.2 FI5.2 U1.27(SDA) U2.15(SDA) U5.13(SDA) U6.5(SDA) U7.5(SDA) ZYMKEY4.3
SENSOR0: FS1.2 R8.1 U2.1(CH0)
SENSOR1: FS4.2 R9.1 U2.2(CH1)
SENSOR2: FS6.2 R10.1 U2.3(CH2)
SENSOR3: FS8.2 R11.1 U2.4(CH3)
SENSOR4: FS9.2 R12.1 U2.5(CH4)
SENSOR5: FS11.2 R13.1 U2.6(CH5)
SENSOR6: FS14.2 U2.7(CH6)
USB1_N: D1.6 U10.10(DM1)
USB1_P: D1.4 U10.11(DP1)
USB2_N: D2.6 U10.8(DM2)
USB2_P: D2.4 U10.9(DP2)
USB3_N: D3.6 U10.6(DM3)
USB3_P: D3.4 U10.7(DP3)
USB4_N: D4.6 U10.4(DM4)
USB4_P: D4.4 U10.5(DP4)
USB5_N: U12.6(DM3) U14.6(DM)
USB5_P: U12.7(DP3) U14.5(DP)
USB6_N: U12.8(DM2) U16.6(DM)
USB6_P: U12.9(DP2) U16.5(DP)
USB7_N: U13.10(DM1) U24.6(DM)
USB7_P: U13.11(DP1) U24.5(DP)
USB8_N: U13.8(DM2) U22.6(DM)
USB8_P: U13.9(DP2) U22.5(DP)
USB9_N: U13.6(DM3) U20.6(DM)
USB9_P: U13.7(DP3) U20.5(DP)
USB10_N: U13.4(DM4) U18.6(DM)
USB10_P: U13.5(DP4) U18.5(DP)
USB_N: CN2.99 USB_DBG.A7(DN1) USB_DBG.B7(DN2) USB_SW.4
USB_OTG_ID: CN2.100 SETTING.7
USB_P: CN2.98 USB_DBG.A6(DP1) USB_DBG.B6(DP2) USB_SW.2
USB_S1_N: D10.6 U11.10(DM1)
USB_S1_P: D10.4 U11.11(DP1)
USB_S2_N: D9.6 U11.8(DM2)
USB_S2_P: D9.4 U11.9(DP2)
USB_S3_N: U10.15(DMU) U11.6(DM3)
USB_S3_P: U10.16(DPU) U11.7(DP3)
USB_S4_N: U11.4(DM4) U12.15(DMU)
USB_S4_P: U11.5(DP4) U12.16(DPU)
USB_S5_N: U12.10(DM1) U13.15(DMU)
USB_S5_P: U12.11(DP1) U13.16(DPU)
Net-(ACTIVE-1): ACTIVE.1(K) R22.1
Net-(BAT-1): BAT.1 U6.3(VBAT)
Net-(C3-2): C3.2 C4.2 U12.13(VD33) U12.17(XRSTJ) U12.18(VBUSM) U12.19(BUSJ) U12.21(VD33_O) U12.26(OVCJ) U12.27(TESTJ)
Net-(C6-2): C6.2 C8.2 U12.12(VD18_O) U12.28(VD18)
Net-(C7-1): C7.1 U10.3(XIN) X1.1(OSC1)
Net-(C9-2): C9.2 U10.2(XOUT) X1.3(OSC2)
Net-(C10-2): C10.2 C11.2 U10.12(VD18_O) U10.28(VD18)
Net-(C12-2): C12.2 U12.2(XOUT) X2.3(OSC2)
Net-(C13-1): C13.1 C14.2 D8.2(K) U8.1(VIN)
Net-(C15-1): C15.1 U12.3(XIN) X2.1(OSC1)
Net-(C16-2): C16.2 C17.2 U10.13(VD33) U10.17(XRSTJ) U10.18(VBUSM) U10.19(BUSJ) U10.21(VD33_O) U10.26(OVCJ) U10.27(TESTJ)
Net-(C18-1): C18.1 U11.3(XIN) X4.1(OSC1)
Net-(C20-2): C20.2 U11.2(XOUT) X4.3(OSC2)
Net-(C21-2): C21.2 C22.2 U11.12(VD18_O) U11.28(VD18)
Net-(C23-2): C23.2 C24.2 U11.13(VD33) U11.17(XRSTJ) U11.18(VBUSM) U11.19(BUSJ) U11.21(VD33_O) U11.26(OVCJ) U11.27(TESTJ)
Net-(C26-2): C26.2 H1.2 U15.8(VDD2)
Net-(C28-2): C28.2 H2.2 U17.8(VDD2)
Net-(C30-2): C30.2 H3.2 U19.8(VDD2)
Net-(C32-1): C32.1 C33.2 L5.2 L6.1 U8.4(FB)
Net-(C37-2): C37.2 C38.2 U13.13(VD33) U13.17(XRSTJ) U13.18(VBUSM) U13.19(BUSJ) U13.21(VD33_O) U13.26(OVCJ) U13.27(TESTJ)
Net-(C39-2): C39.2 C40.2 U13.12(VD18_O) U13.28(VD18)
Net-(C41-2): C41.2 U13.2(XOUT) X5.3(OSC2)
Net-(C42-1): C42.1 U13.3(XIN) X5.1(OSC1)
Net-(C44-2): C44.2 H4.2 U21.8(VDD2)
Net-(C46-2): C46.2 H5.2 U23.8(VDD2)
Net-(C48-2): C48.2 H6.2 U25.8(VDD2)
Net-(C55-2): C55.2 C56.1 D11.2(K) U9.1(VIN)
Net-(C57-2): C57.2 C59.1 L1.2 L2.1 U9.4(FB)
Net-(D1-1): D1.1 USB1.2(D-)
Net-(D1-3): D1.3 USB1.3(D+)
Net-(D2-1): D2.1 USB2.2(D-)
Net-(D2-3): D2.3 USB2.3(D+)
Net-(D3-1): D3.1 USB3.2(D-)
Net-(D3-3): D3.3 USB3.3(D+)
Net-(D4-1): D4.1 USB4.2(D-)
Net-(D4-3): D4.3 USB4.3(D+)
Net-(D5-2): D5.2(K) L1.1 U9.2(OUTPUT)
Net-(D6-1): D6.1(-) F1.1
Net-(D7-2): D7.2(K) L5.1 U8.2(OUTPUT)
Net-(D9-1): D9.1 USB_S34.6(D-)
Net-(D9-3): D9.3 USB_S34.7(D+)
Net-(D10-1): D10.1 USB_S34.2(D-)
Net-(D10-3): D10.3 USB_S34.3(D+)
Net-(DR1-2): DR1.2(+) QR1.3(D) RL1.1
Net-(DR2-2): DR2.2(+) QR2.3(D) RL2.1
Net-(DR3-2): DR3.2(+) QR3.3(D) RL3.1
Net-(DR4-2): DR4.2(+) QR4.3(D) RL4.1
Net-(DR5-2): DR5.2(+) QR5.3(D) RL5.1
Net-(DR6-2): DR6.2(+) QR6.3(D) RL6.4
Net-(DR7-2): DR7.2(+) QR7.3(D) RL7.4
Net-(F4-1): F4.1 IRLED.1
Net-(F4-2): F4.2 R14.2
Net-(F5-1): F5.1 IRLED.2
Net-(F5-2): F5.2 QR8.3(D)
Net-(FI1-1): FI1.1 I2C_1.1
Net-(FI2-1): FI2.1 I2C_1.2
Net-(FI3-1): FI3.1 I2C_1.3
Net-(FI4-1): FI4.1 I2C_1.4
Net-(FI5-1): FI5.1 I2C_2.4
Net-(FI6-1): FI6.1 I2C_2.3
Net-(FI7-1): FI7.1 I2C_2.2
Net-(FI8-1): FI8.1 I2C_2.1
Net-(FIN1-1): FIN1.1 INPUT0.2
Net-(FIN1-2): FIN1.2 OC1.1
Net-(FIN2-1): FIN2.1 INPUT0.1
Net-(FIN2-2): FIN2.2 R15.1
Net-(FIN3-1): FIN3.1 INPUT1.2
Net-(FIN3-2): FIN3.2 OC2.1
Net-(FIN4-1): FIN4.1 INPUT1.1
Net-(FIN4-2): FIN4.2 R18.1
Net-(FIN5-1): FIN5.1 INPUT2.2
Net-(FIN5-2): FIN5.2 OC3.1
Net-(FIN6-1): FIN6.1 INPUT2.1
Net-(FIN6-2): FIN6.2 R20.1
Net-(FIN7-1): FIN7.1 INPUT3.2
Net-(FIN7-2): FIN7.2 OC4.1
Net-(FIN8-1): FIN8.1 INPUT3.1
Net-(FIN8-2): FIN8.2 R24.1
Net-(FS1-1): FS1.1 SEN0.1
Net-(FS2-1): FS2.1 SEN0.2
Net-(FS3-1): FS3.1 SEN1.2
Net-(FS4-1): FS4.1 SEN1.1
Net-(FS5-1): FS5.1 SEN2.2
Net-(FS6-1): FS6.1 SEN2.1
Net-(FS7-1): FS7.1 SEN3.2
Net-(FS8-1): FS8.1 SEN3.1
Net-(FS9-1): FS9.1 SEN4.1
Net-(FS10-1): FS10.1 SEN4.2
Net-(FS11-1): FS11.1 SEN5.1
Net-(FS12-1): FS12.1 SEN5.2
Net-(FS13-1): FS13.1 SEN6.1
Net-(FS14-1): FS14.1 SEN6.2
Net-(FS15-1): FS15.1 SEN6.3
Net-(FU1-1): FU1.1 USB1.1(VBUS)
Net-(FU2-1): FU2.1 USB2.1(VBUS)
Net-(FU3-1): FU3.1 USB3.1(VBUS)
Net-(FU4-1): FU4.1 USB4.1(VBUS)
Net-(FU9-1): FU9.1 USB_S34.5(VBUS)
Net-(FU10-1): FU10.1 USB_S34.1(VBUS)
Net-(FU11-2): FU11.2 PWM01.4
Net-(FU12-1): FU12.1 QL1.3(D)
Net-(FU12-2): FU12.2 PWM01.3
Net-(FU13-2): FU13.2 PWM01.2
Net-(FU14-1): FU14.1 QL2.3(D)
Net-(FU14-2): FU14.2 PWM01.1
Net-(FU16-1): FU16.1 QL3.3(D)
Net-(FU16-2): FU16.2 PWM23.3
Net-(FU17-2): FU17.2 PWM23.2
Net-(FU18-1): FU18.1 QL4.3(D)
Net-(FU18-2): FU18.2 PWM23.1
Net-(FU19-2): FU19.2 PWM45.4
Net-(FU20-1): FU20.1 QL5.3(D)
Net-(FU20-2): FU20.2 PWM45.3
Net-(FU21-2): FU21.2 PWM45.2
Net-(FU22-1): FU22.1 QL6.3(D)
Net-(FU22-2): FU22.2 PWM45.1
Net-(FU23-2): FU23.2 PWM67.4
Net-(FU24-1): FU24.1 QL7.3(D)
Net-(FU24-2): FU24.2 PWM67.3
Net-(FU25-2): FU25.2 PWM67.2
Net-(FU26-1): FU26.1 QL8.3(D)
Net-(FU26-2): FU26.2 PWM67.1
Net-(FU115-2): FU115.2 PWM23.4
Net-(OC1-2): OC1.2 R15.2
Net-(OC2-2): OC2.2 R18.2
Net-(OC3-2): OC3.2 R20.2
Net-(OC4-2): OC4.2 R24.2
Net-(POWER-1): POWER.1(-) R21.1
Net-(R1-1): R1.1 USB_DBG.A5(CC1)
Net-(R2-2): R2.2 U10.14(REXT)
Net-(R3-2): R3.2 U12.14(REXT)
Net-(R4-2): R4.2 U11.14(REXT)
Net-(R5-2): R5.2 USB_DBG.B5(CC2)
Net-(R6-2): R6.2 U13.14(REXT)
Net-(R7-1): R7.1 U1.23(OE#)
Net-(RL1-2): RL1.2 SW0.3
Net-(RL1-3): RL1.3 SW0.2
Net-(RL1-4): RL1.4 SW0.1
Net-(RL2-2): RL2.2 SW1.3
Net-(RL2-3): RL2.3 SW1.2
Net-(RL2-4): RL2.4 SW1.1
Net-(RL3-2): RL3.2 SW2.3
Net-(RL3-3): RL3.3 SW2.2
Net-(RL3-4): RL3.4 SW2.1
Net-(RL4-2): RL4.2 SW3.3
Net-(RL4-3): RL4.3 SW3.2
Net-(RL4-4): RL4.4 SW3.1
Net-(RL5-2): RL5.2 SW4.3
Net-(RL5-3): RL5.3 SW4.2
Net-(RL5-4): RL5.4 SW4.1
Net-(RL6-2): RL6.2 SW5.1
Net-(RL6-3): RL6.3 SW5.3
Net-(RL6-5): RL6.5 SW5.2
Net-(RL7-2): RL7.2 SW6.1
Net-(RL7-3): RL7.3 SW6.3
Net-(RL7-5): RL7.5 SW6.2
Net-(U6-1): U6.1(X1) X3.1(OSC1)
Net-(U6-2): U6.2(X2) X3.2(OSC2)
Net-(U11-15): U11.15(DMU) USB_SW.3
Net-(U11-16): U11.16(DPU) USB_SW.1
Net-(U14-2): U14.2(TXD) U15.3(VIB)
Net-(U14-4): U14.4(RXD) U15.2(VOA)
Net-(U15-6): U15.6(VOB) UART0.3
Net-(U15-7): U15.7(VIA) UART0.1
Net-(U16-2): U16.2(TXD) U17.3(VIB)
Net-(U16-4): U16.4(RXD) U17.2(VOA)
Net-(U17-6): U17.6(VOB) UART1.3
Net-(U17-7): U17.7(VIA) UART1.1
Net-(U18-2): U18.2(TXD) U19.3(VIB)
Net-(U18-4): U18.4(RXD) U19.2(VOA)
Net-(U19-6): U19.6(VOB) UART2.3
Net-(U19-7): U19.7(VIA) UART2.1
Net-(U20-2): U20.2(TXD) U21.3(VIB)
Net-(U20-4): U20.4(RXD) U21.2(VOA)
Net-(U21-6): U21.6(VOB) UART3.3
Net-(U21-7): U21.7(VIA) UART3.1
Net-(U22-2): U22.2(TXD) U23.3(VIB)
Net-(U22-4): U22.4(RXD) U23.2(VOA)
Net-(U23-6): U23.6(VOB) UART4.3
Net-(U23-7): U23.7(VIA) UART4.1
Net-(U24-2): U24.2(TXD) U25.3(VIB)
Net-(U24-4): U24.4(RXD) U25.2(VOA)
Net-(U25-6): U25.6(VOB) UART5.3
Net-(U25-7): U25.7(VIA) UART5.1

Not connected (* = marked no-connect by the designer): CN1 2* 3* 5* 6* 8* 9* 12* 14* 18* 19* 20* 22* 23* 25* 31* 32* 34* 35* 36* 38* 40* 41* 46* 47* 48* 50* 52* 55* 56* 63* 64* 66* 67* 69* 70* 72* 77* 78* 80* 81* 83* 86* 87* 91* 92* 93* 95* 96* 98* 99*; CN2 1* 2* 3* 5* 6* 8* 9* 11* 12* 14* 15* 17* 18* 20* 21* 23* 24* 26* 27* 29* 30* 32* 33* 47* 48* 53* 54* 56* 57* 59* 60* 62* 63* 65* 66* 68* 69* 71* 72* 76* 77* 78* 79* 80* 81* 83* 84* 86* 87* 89* 90* 92* 93* 95* 96*; HDMI 14(HEC)*; RL1 5* 6* 7*; RL2 5* 6* 7*; RL3 5* 6* 7*; RL4 5* 6* 7*; RL5 5* 6* 7*; U1 15(LED8)* 16(LED9)* 17(LED10)* 18(LED11)* 19(LED12)* 20(LED13)* 21(LED14)* 22(LED15)*; U2 8(CH7)*; U5 8(GPB7)* 11(NC)* 14(NC)* 25(GPA4)* 26(GPA5)* 27(GPA6)* 28(GPA7)*; U6 7(SQWOUT)*; U10 22(DRV)* 23(LED1)* 24(LED2)* 25(PWRJ)*; U11 22(DRV)* 23(LED1)* 24(LED2)* 25(PWRJ)*; U12 4(DM4)* 5(DP4)* 22(DRV)* 23(LED1)* 24(LED2)* 25(PWRJ)*; U13 22(DRV)* 23(LED1)* 24(LED2)* 25(PWRJ)*; U14 8(VO_33)*; U16 8(VO_33)*; U18 8(VO_33)*; U20 8(VO_33)*; U22 8(VO_33)*; U24 8(VO_33)*; USB_DBG A8(SBU1)* B8(SBU2)*

## Notes on the sheets
sheet 1
- RTC
- LED Indicators
- I2C External Devices
- Power Distribution
- GPIO
- HDMI
- VREF=3.3
- Used for Ethernet LED
- Used for SD_CARD power
